# EAGLE design Titan_v1p0 (EAGLE 9.6.2)
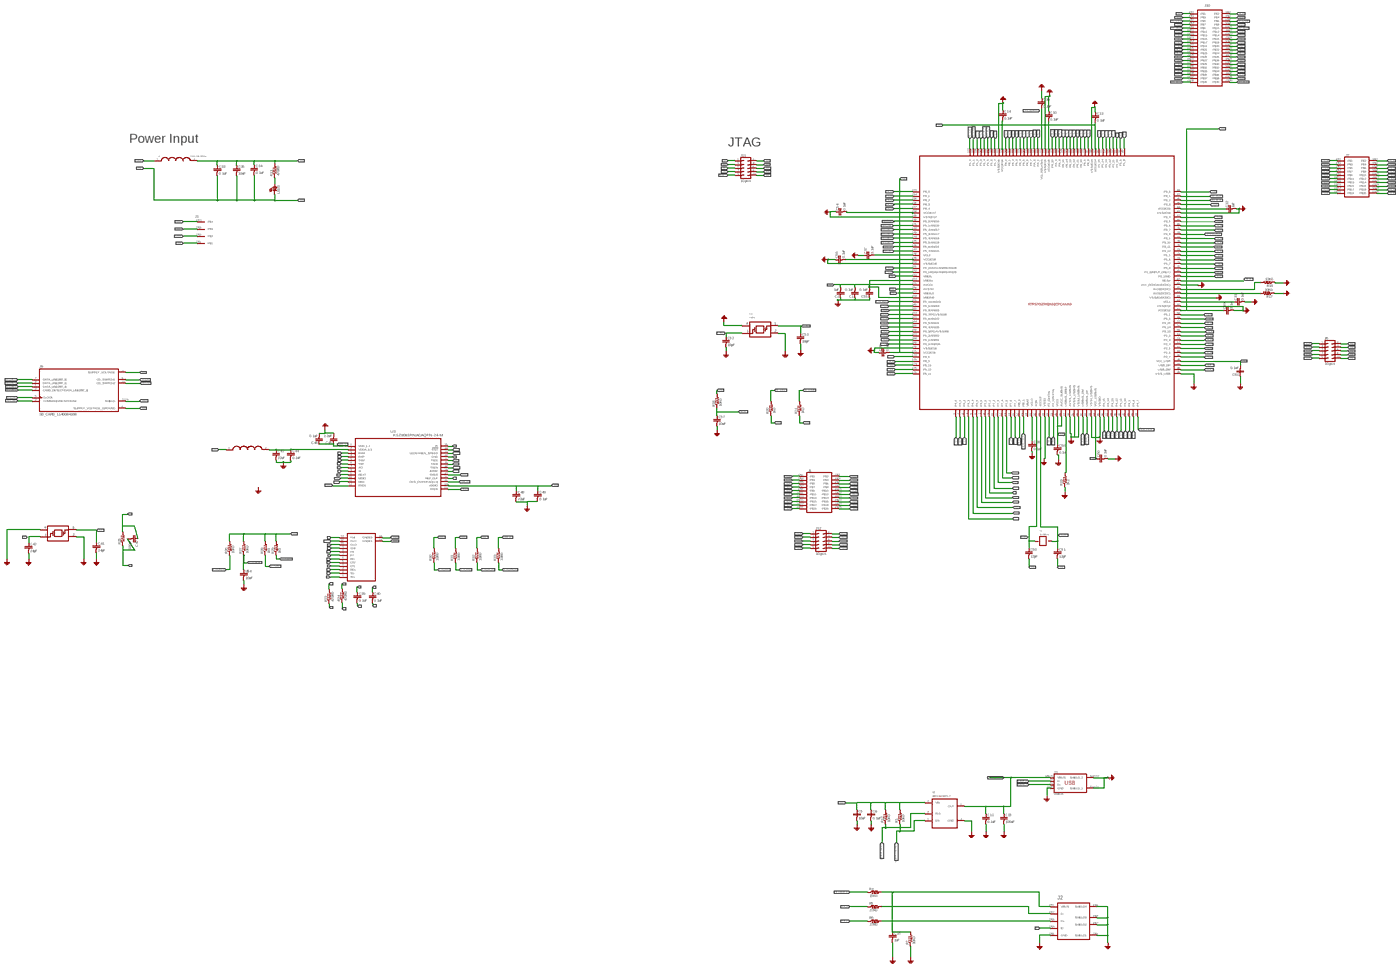
[diagram p0: schematic, sheet 1, overview]
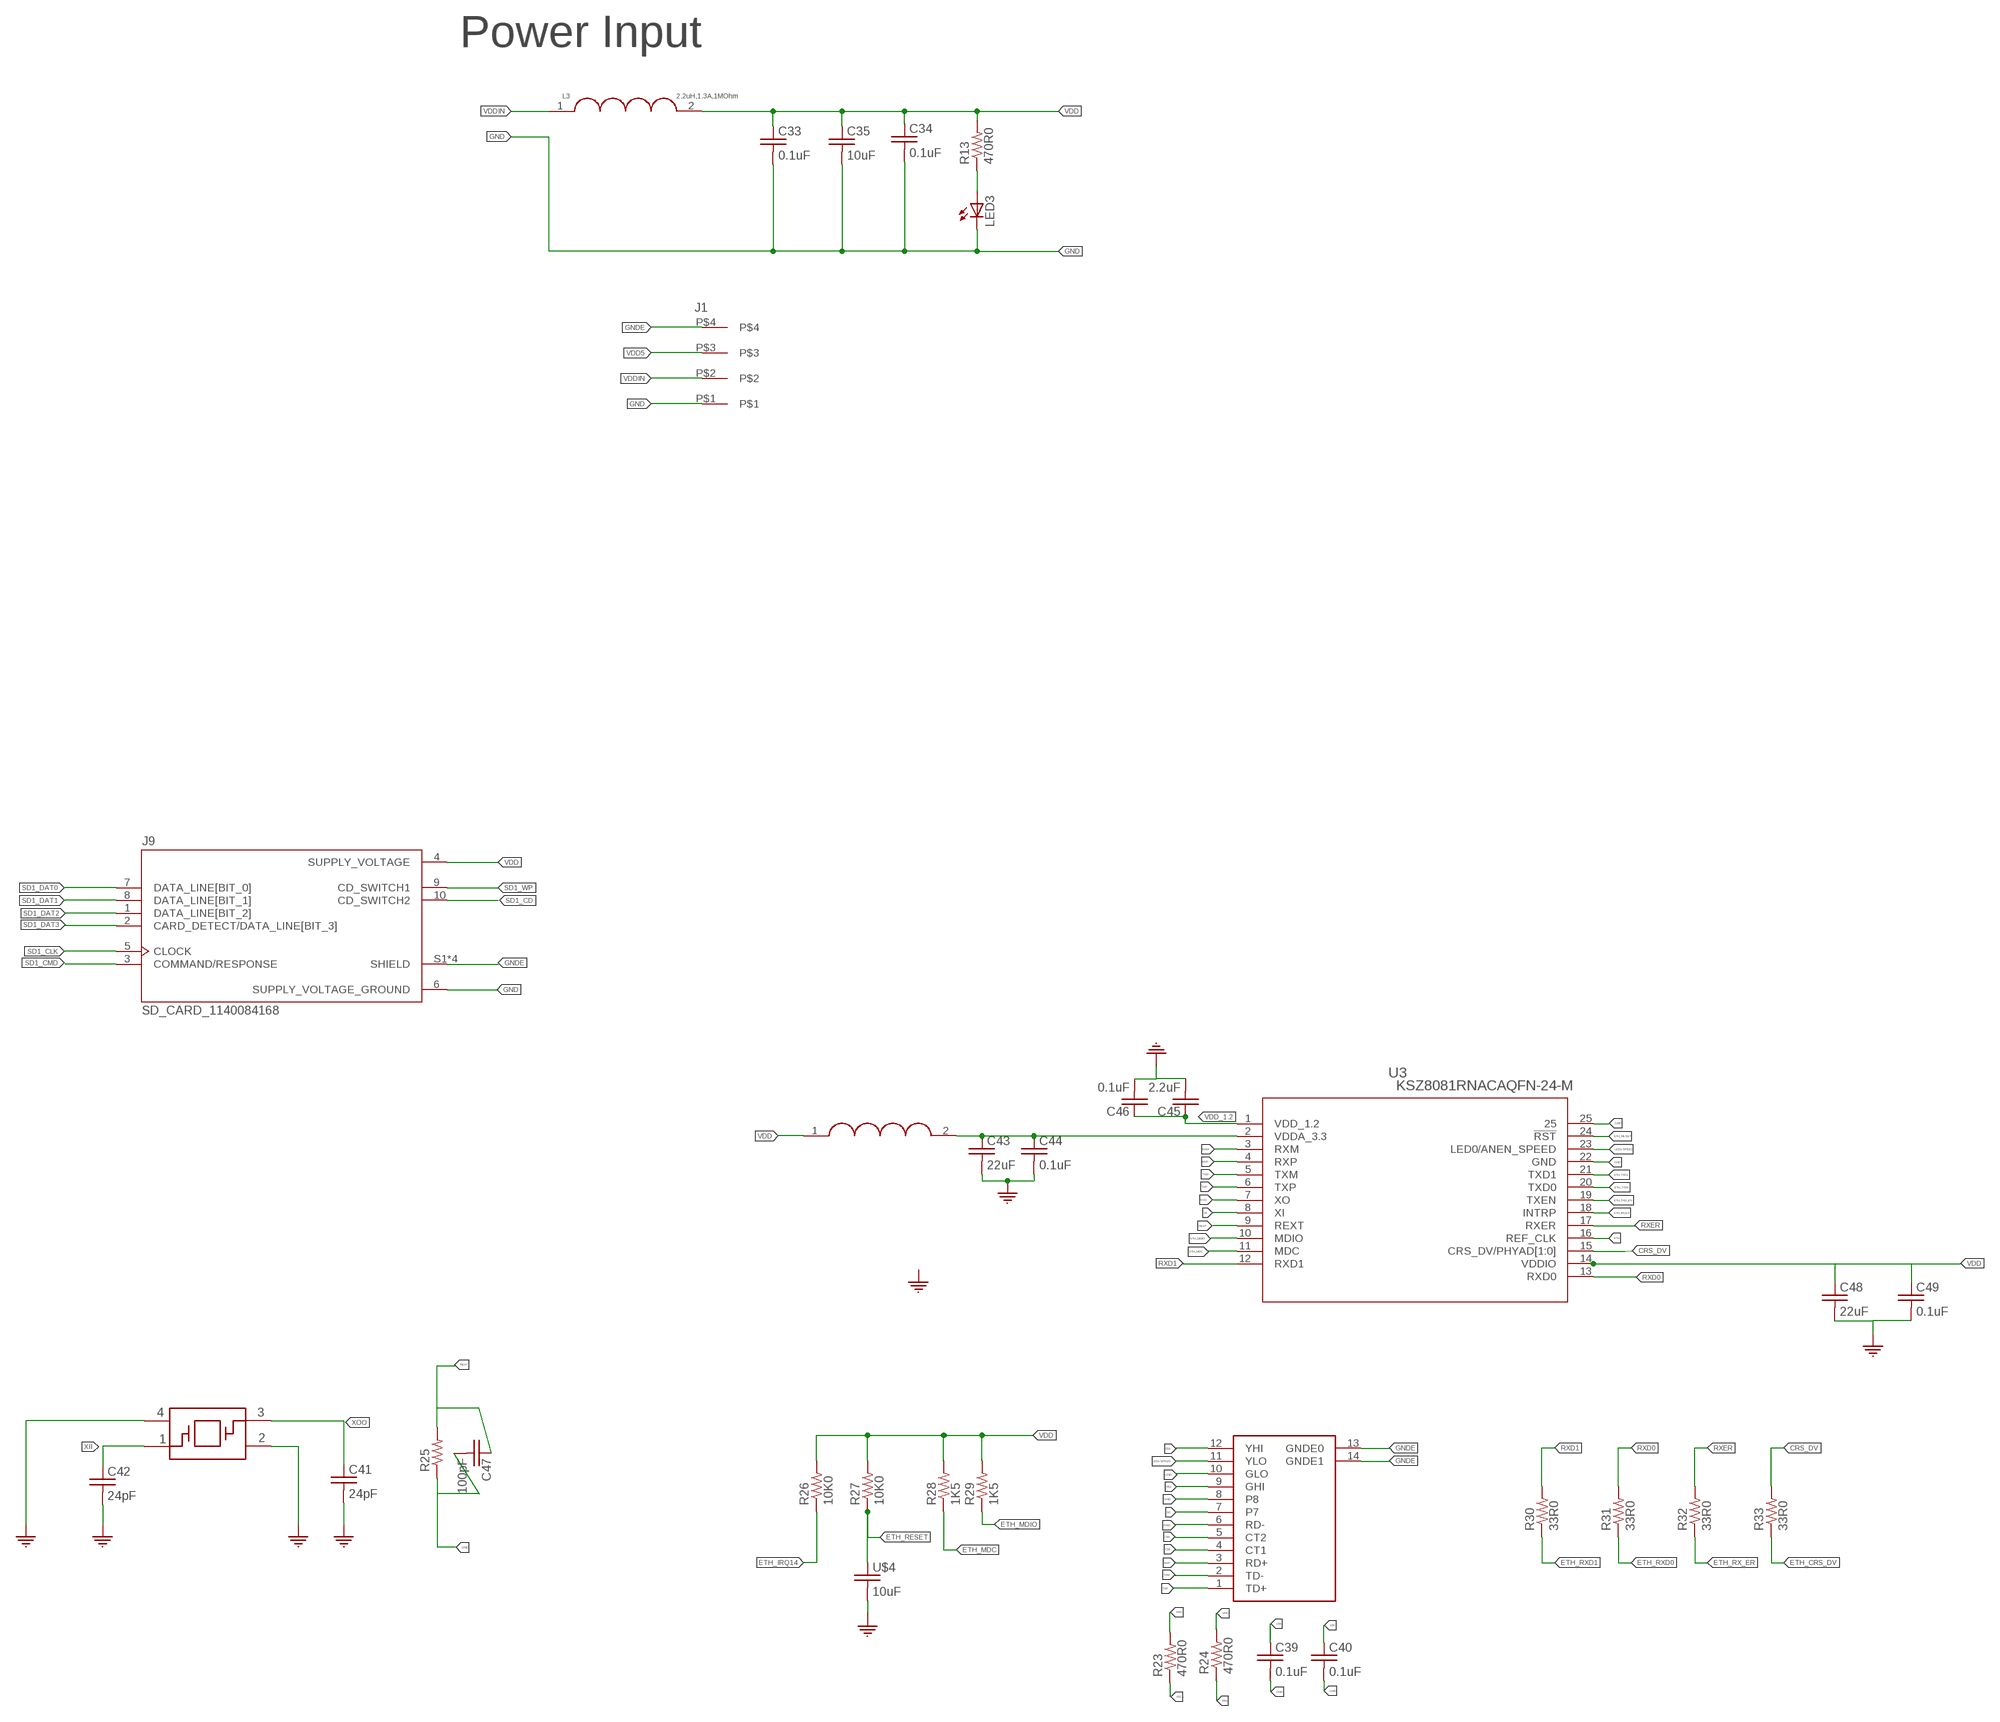
[diagram p1: schematic, sheet 1, part 1 of 4]
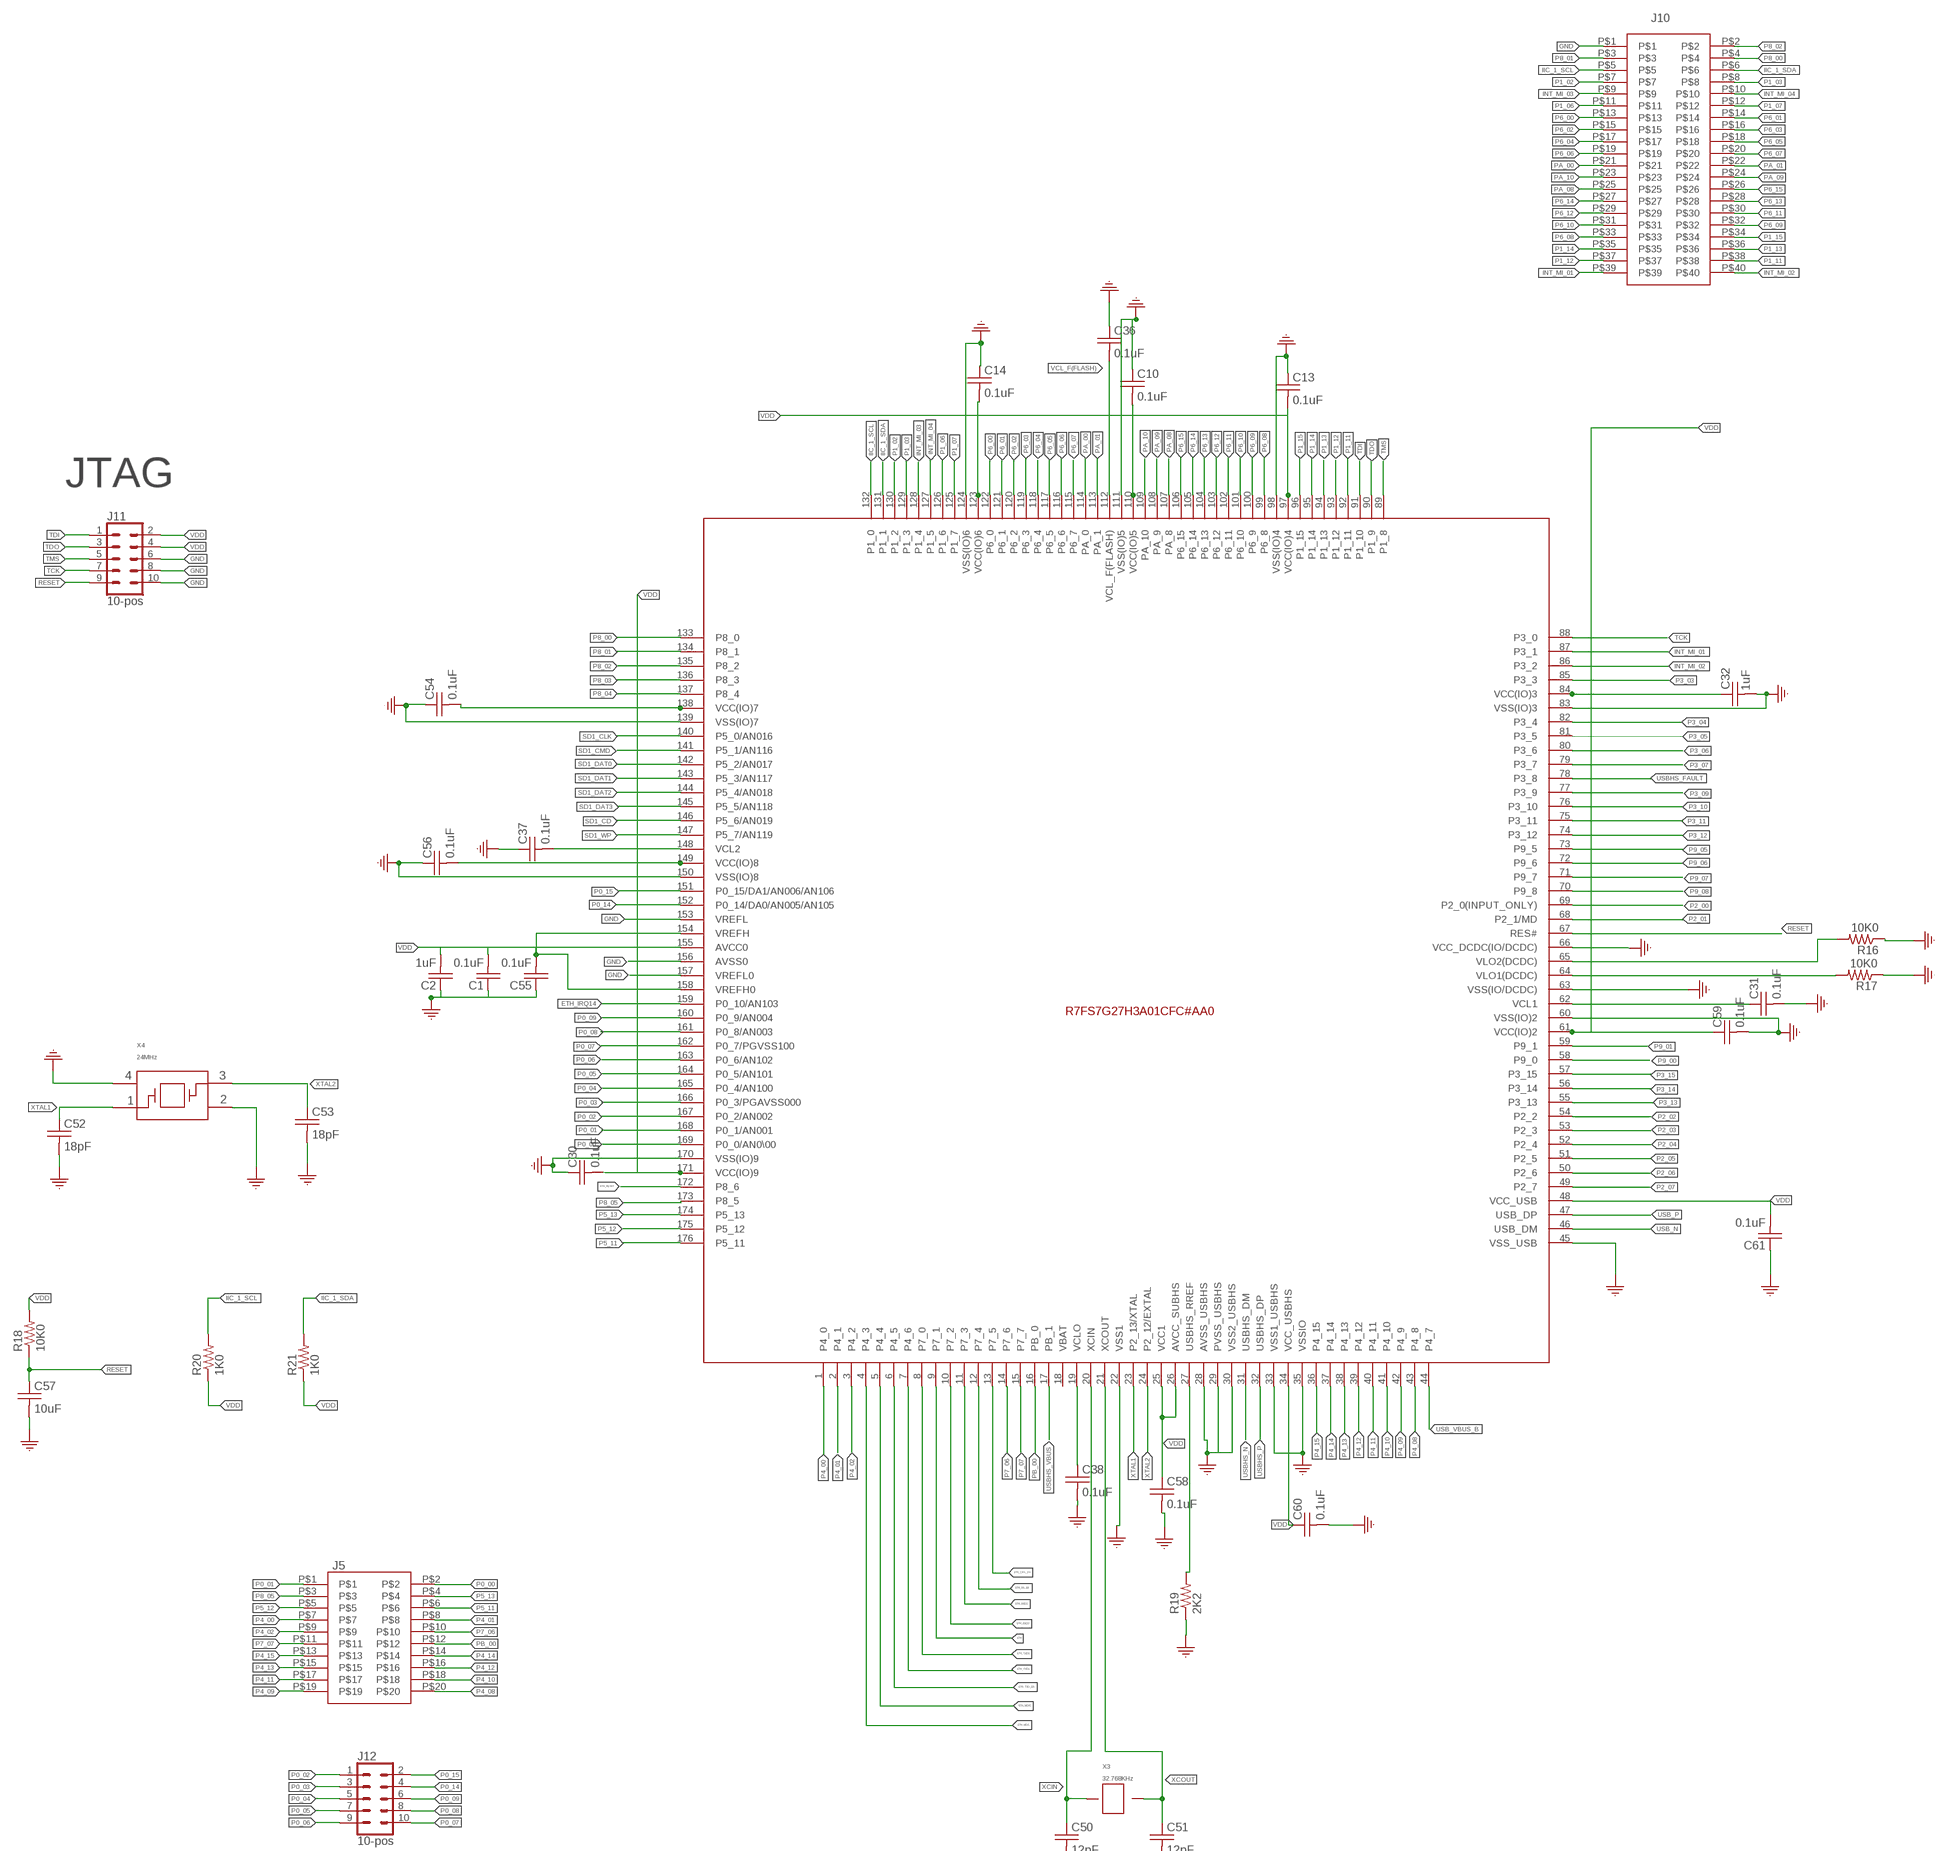
[diagram p2: schematic, sheet 1, part 2 of 4]
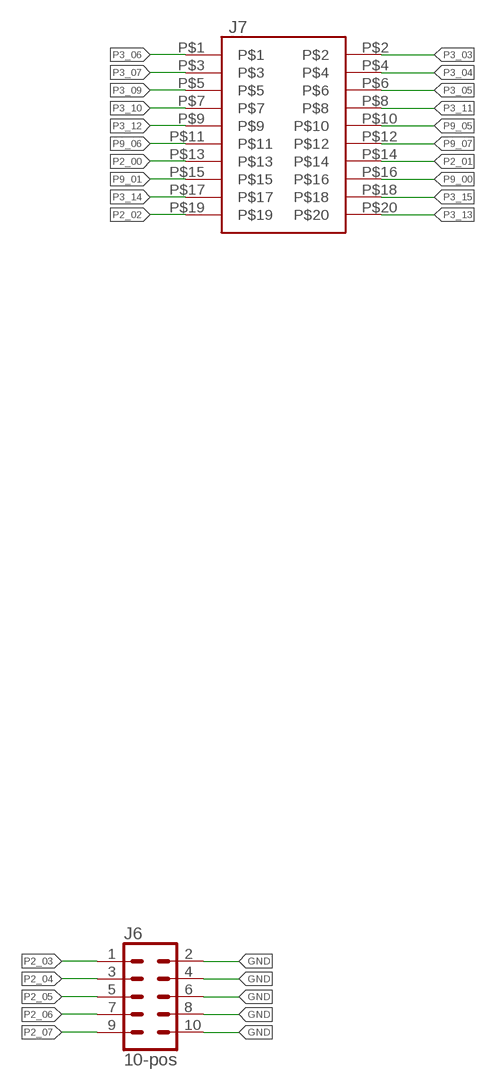
[diagram p3: schematic, sheet 1, part 3 of 4]
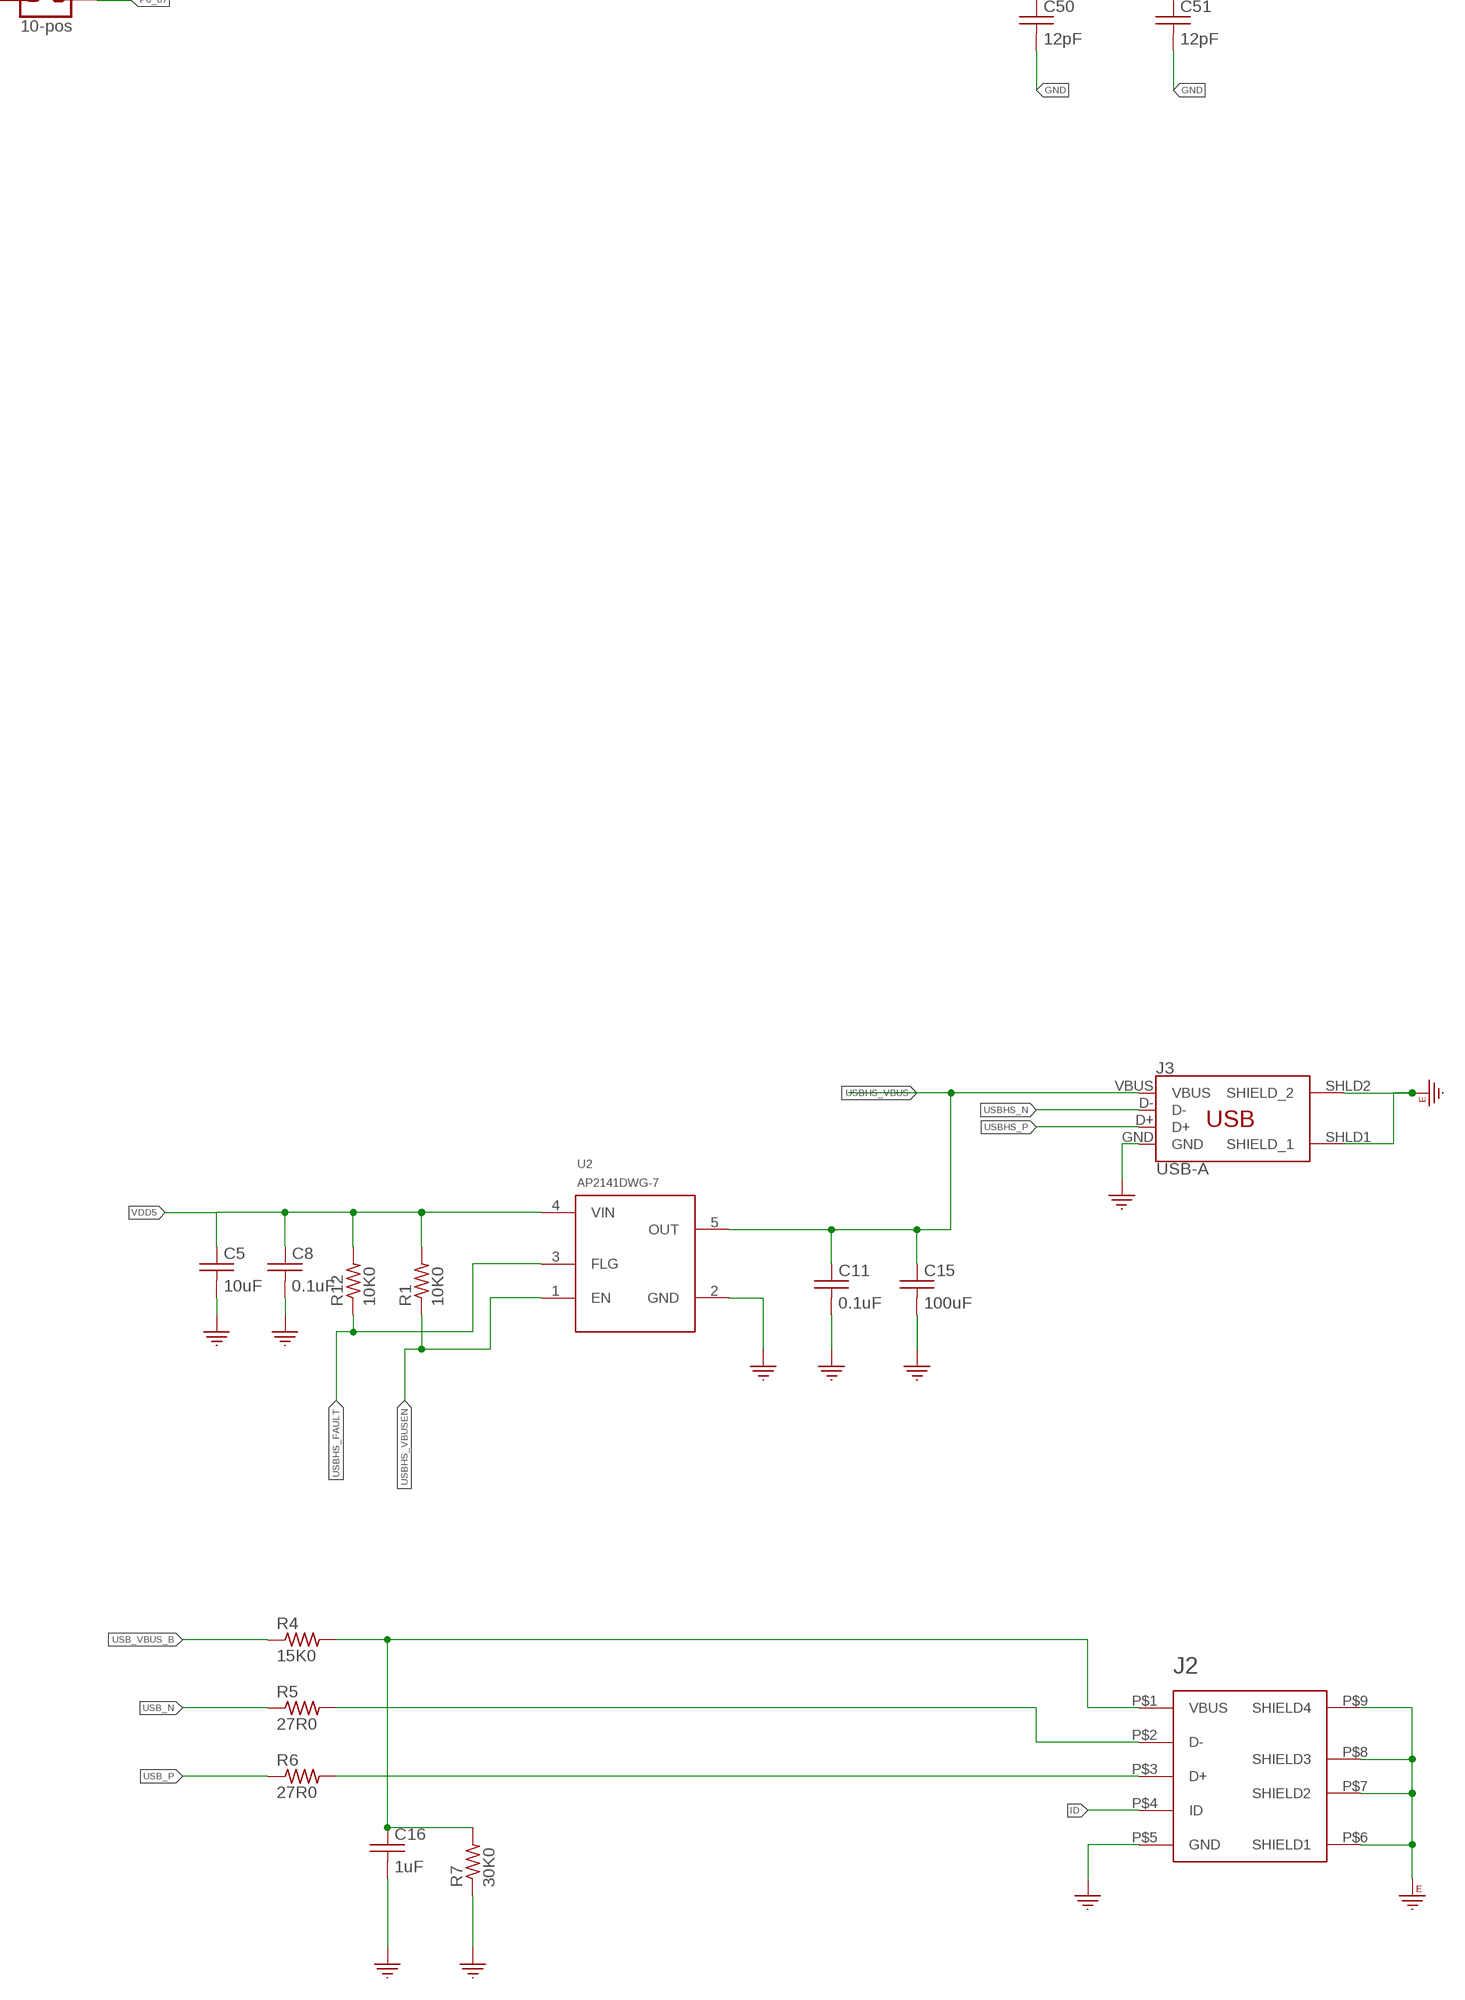
[diagram p4: schematic, sheet 1, part 4 of 4]

## Parts
C1  0.1uF  C_0402_0.1UF  [0402]
C2  1uF  C_0402_1UF  [0402]
C5  10uF  C_0402_10UF  [0402]
C8  0.1uF  C_0402_0.1UF  [0402]
C10  0.1uF  C_0402_0.1UF  [0402]
C11  0.1uF  C_0402_0.1UF  [0402]
C13  0.1uF  C_0402_0.1UF  [0402]
C14  0.1uF  C_0402_0.1UF  [0402]
C15  100uF  C_1210  [C1210]
C16  1uF  C_0402_1UF  [0402]
C30  0.1uF  C_0402_0.1UF  [0402]
C31  0.1uF  C_0402_0.1UF  [0402]
C32  1uF  C_0402_1UF  [0402]
C33  0.1uF  C_0402_0.1UF  [0402]
C34  0.1uF  C_0402_0.1UF  [0402]
C35  10uF  C_0402_10UF  [0402]
C36  0.1uF  C_0402_0.1UF  [0402]
C37  0.1uF  C_0402_0.1UF  [0402]
C38  0.1uF  C_0402_0.1UF  [0402]
C39  0.1uF  C_0402_0.1UF  [0402]
C40  0.1uF  C_0402_0.1UF  [0402]
C41  24pF  C_0402_24PF  [0402]
C42  24pF  C_0402_24PF  [0402]
C43  22uF  C_0402_22UF  [0402]
C44  0.1uF  C_0402_0.1UF  [0402]
C45  2.2uF  C_0402_2.2UF  [0402]
C46  0.1uF  C_0402_0.1UF  [0402]
C47  100pF  C_0402_100PF  [0402]
C48  22uF  C_0402_22UF  [0402]
C49  0.1uF  C_0402_0.1UF  [0402]
C50  12pF  C_0402_12PF  [0402]
C51  12pF  C_0402_12PF  [0402]
C52  18pF  C_0402_18PF  [0402]
C53  18pF  C_0402_18PF  [0402]
C54  0.1uF  C_0402_0.1UF  [0402]
C55  0.1uF  C_0402_0.1UF  [0402]
C56  0.1uF  C_0402_0.1UF  [0402]
C57  10uF  C_0402_10UF  [0402]
C58  0.1uF  C_0402_0.1UF  [0402]
C59  0.1uF  C_0402_0.1UF  [0402]
C60  0.1uF  C_0402_0.1UF  [0402]
C61  0.1uF  C_0402_0.1UF  [0402]
FB2/2  120Ohm  FB_0603_120_OHM0603  [0603]
J1  4-pos  3.81MM_1_X_4_RT_ANGLE_PLUG_HEADER  [1X4_3.81MM_PITCH]
J2  USB-B-Micro  USB_MICRO-B  [USB_MICRO-B]
J3  USB-A  USB_A  [USB_A_SMT]
J4  RJ45  RJ45_WITH_ELEC  [RJ45_TH_ELEC]
J5  20-pos  2_X_10_HEADER_GENERIC  [2_X_10_.1_INCH]
J6  10-pos  CONN_05X2_RAPTH  [2X5]
J7  20-pos  2_X_10_HEADER_GENERIC  [2_X_10_.1_INCH]
J9  SD_CARD_1140084168  [AMPHENOL_1140084168]
J10  40-pos  HEADER_2_X_20_GENERIC  [HEADER_2_X_20_.1_INCH]
J11  10-pos  CONN_05X2_RAPTH  [2X5]
J12  10-pos  CONN_05X2_RAPTH  [2X5]
L3  2.2uH,1.3A,1MOhm  INDUCTOR_1008_2.2_MH_1.3A  [1008]
LED3  Green  LED_0805_GREEN  [0805]
R1  10K0  R_0402_10K0  [0402]
R4  15K0  R_0402_15K0  [0402]
R5  27R0  R_0402_27R0  [0402]
R6  27R0  R_0402_27R0  [0402]
R7  30K0  R_0402_30K0  [0402]
R12  10K0  R_0402_10K0  [0402]
R13  470R0  R_0402_470R0  [0402]
R16  10K0  R_0402_10K0  [0402]
R17  10K0  R_0402_10K0  [0402]
R18  10K0  R_0402_10K0  [0402]
R19  2K2  R_0402_2K2  [0402]
R20  1K0  R_0402_1K0  [0402]
R21  1K0  R_0402_1K0  [0402]
R23  470R0  R_0402_470R0  [0402]
R24  470R0  R_0402_470R0  [0402]
R25  6K49  R_0402_6K49  [0402]
R26  10K0  R_0402_10K0  [0402]
R27  10K0  R_0402_10K0  [0402]
R28  1K5  R_0402_1K5  [0402]
R29  1K5  R_0402_1K5  [0402]
R30  33R0  R_0402_33R0  [0402]
R31  33R0  R_0402_33R0  [0402]
R32  33R0  R_0402_33R0  [0402]
R33  33R0  R_0402_33R0  [0402]
U2  AP2151DWG-7  [SOT-23-5]
U3  KSZ8081RNACAQFN-24-M  [QFN-24-M]
U4  S7G2LQFP176  S7G2_X_176  [LQFP176_24X24]
U5  25MHz  XTAL_25_MHZ  [SMD_3225]
U$4  10uF  C_0402_10UF  [0402]
X3  32.768KHz  XTAL_32.768KHZ  [SMD_X_2_PADS]
X4  24MHz  XTAL_24_MHZ  [SMD_3225]

## Nets
C58: C39.P$1 J4.4(CT1)
C60: C40.P$1 J4.5(CT2)
CRS_DV: R33.P$2 U3.15(CRS_DV/PHYAD[1:0])
D+: J2.P$3(D+) R6.P$2
D-: J2.P$2(D-) R5.P$2
ETH: U3.16(REF_CLK) U4.9(P7_1)
ETH_CRS_DV: R33.P$1 U4.13(P7_5)
ETH_IRQ14: R26.P$1 U3.18(INTRP) U4.159(P0_10/AN103)
ETH_MDC: R28.P$1 U3.11(MDC) U4.4(P4_3)
ETH_MDIO: R29.P$1 U3.10(MDIO) U4.5(P4_4)
ETH_RESET: R27.P$1 U3.24(!RST) U4.172(P8_6) U$4.P$1
ETH_RX_ER: R32.P$1 U4.12(P7_4)
ETH_RXD0: R31.P$1 U4.10(P7_2)
ETH_RXD1: R30.P$1 U4.11(P7_3)
ETH_TXD0: U3.20(TXD0) U4.8(P7_0)
ETH_TXD1: U3.21(TXD1) U4.7(P4_6)
ETH_TXD_EN: U3.19(TXEN) U4.6(P4_5)
GND: C1.P$1 C2.P$1 C5.P$2 C8.P$2 C10.P$1 C11.P$2 C13.P$1 C14.P$1 C15.2 C16.P$2 C30.P$1 C31.P$2 C32.P$2 C33.P$2 C34.P$2 C35.P$2 C36.P$1 C37.P$1 C38.P$2 C39.P$2 C40.P$2 C41.P$2 C42.P$2 C43.P$2 C44.P$2 C45.P$2 C46.P$2 C47.P$2 C48.P$2 C49.P$2 C50.P$2 C51.P$2 C52.P$2 C53.P$2 C54.P$1 C55.P$1 C56.P$1 C57.P$2 C58.P$2 C59.P$2 C60.P$2 C61.P$1 J1.P$1 J2.P$5(GND) J3.GND J4.8 J4.10(GLO) J6.2 J6.4 J6.6 J6.8 J6.10 J9.6(SUPPLY_VOLTAGE_GROUND) J10.P$1 J11.6 J11.8 J11.10 LED3.2(C) R7.P$1 R16.P$1 R17.P$1 R19.P$1 R25.P$1 U2.2(GND) U3.22(GND) U3.25 U4.22(VSS1) U4.28(AVSS_USBHS) U4.29(PVSS_USBHS) U4.30(VSS2_USBHS) U4.33(VSS1_USBHS) U4.35(VSSIO) U4.45(VSS_USB) U4.60(VSS(IO)2) U4.63(VSS(IO/DCDC)) U4.66(VCC_DCDC(IO/DCDC)) U4.83(VSS(IO)3) U4.98(VSS(IO)4) U4.111(VSS(IO)5) U4.124(VSS(IO)6) U4.139(VSS(IO)7) U4.150(VSS(IO)8) U4.153(VREFL) U4.156(AVSS0) U4.157(VREFL0) U4.170(VSS(IO)9) U5.2 U5.4 U$4.P$2 X4.2 X4.4
GNDE: J1.P$4 J2.P$6(SHIELD1) J2.P$7(SHIELD2) J2.P$8(SHIELD3) J2.P$9(SHIELD4) J3.SHLD1(SHIELD_1) J3.SHLD2(SHIELD_2) J4.13(GNDE0) J4.14(GNDE1) J9.S1(SHIELD) J9.S2(SHIELD) J9.S3(SHIELD) J9.S4(SHIELD)
ID: J2.P$4(ID)
IIC_1_SCL: J10.P$5 R20.P$2 U4.132(P1_0)
IIC_1_SDA: J10.P$6 R21.P$2 U4.131(P1_1)
INT_MI_01: J10.P$39 U4.87(P3_1)
INT_MI_02: J10.P$40 U4.86(P3_2)
INT_MI_03: J10.P$9 U4.128(P1_4)
INT_MI_04: J10.P$10 U4.127(P1_5)
LED1/SPEED: J4.11(YLO) U3.23(LED0/ANEN_SPEED)
N$1: C37.P$2 U4.148(VCL2)
N$3: LED3.1(A) R13.P$1
N$4: C38.P$1 U4.19(VCLO)
N$5: C31.P$1 U4.62(VCL1)
N$6: R17.P$2 U4.64(VLO1(DCDC))
N$7: R16.P$2 U4.65(VLO2(DCDC))
N$8: R19.P$2 U4.27(USBHS_RREF)
NC: J4.7
P0_00: J5.P$2 U4.169(P0_0/AN0\00)
P0_01: J5.P$1 U4.168(P0_1/AN001)
P0_02: J12.1 U4.167(P0_2/AN002)
P0_03: J12.3 U4.166(P0_3/PGAVSS000)
P0_04: J12.5 U4.165(P0_4/AN100)
P0_05: J12.7 U4.164(P0_5/AN101)
P0_06: J12.9 U4.163(P0_6/AN102)
P0_07: J12.10 U4.162(P0_7/PGVSS100)
P0_08: J12.8 U4.161(P0_8/AN003)
P0_09: J12.6 U4.160(P0_9/AN004)
P0_14: J12.4 U4.152(P0_14/DA0/AN005/AN105)
P0_15: J12.2 U4.151(P0_15/DA1/AN006/AN106)
P1_02: J10.P$7 U4.130(P1_2)
P1_03: J10.P$8 U4.129(P1_3)
P1_06: J10.P$11 U4.126(P1_6)
P1_07: J10.P$12 U4.125(P1_7)
P1_11: J10.P$38 U4.92(P1_11)
P1_12: J10.P$37 U4.93(P1_12)
P1_13: J10.P$36 U4.94(P1_13)
P1_14: J10.P$35 U4.95(P1_14)
P1_15: J10.P$34 U4.96(P1_15)
P2_00: J7.P$13 U4.69(P2_0(INPUT_ONLY))
P2_01: J7.P$14 U4.68(P2_1/MD)
P2_02: J7.P$19 U4.54(P2_2)
P2_03: J6.1 U4.53(P2_3)
P2_04: J6.3 U4.52(P2_4)
P2_05: J6.5 U4.51(P2_5)
P2_06: J6.7 U4.50(P2_6)
P2_07: J6.9 U4.49(P2_7)
P3_03: J7.P$2 U4.85(P3_3)
P3_04: J7.P$4 U4.82(P3_4)
P3_05: J7.P$6 U4.81(P3_5)
P3_06: J7.P$1 U4.80(P3_6)
P3_07: J7.P$3 U4.79(P3_7)
P3_09: J7.P$5 U4.77(P3_9)
P3_10: J7.P$7 U4.76(P3_10)
P3_11: J7.P$8 U4.75(P3_11)
P3_12: J7.P$9 U4.74(P3_12)
P3_13: J7.P$20 U4.55(P3_13)
P3_14: J7.P$17 U4.56(P3_14)
P3_15: J7.P$18 U4.57(P3_15)
P4_00: J5.P$7 U4.1(P4_0)
P4_01: J5.P$8 U4.2(P4_1)
P4_02: J5.P$9 U4.3(P4_2)
P4_08: J5.P$20 U4.43(P4_8)
P4_09: J5.P$19 U4.42(P4_9)
P4_10: J5.P$18 U4.41(P4_10)
P4_11: J5.P$17 U4.40(P4_11)
P4_12: J5.P$16 U4.39(P4_12)
P4_13: J5.P$15 U4.38(P4_13)
P4_14: J5.P$14 U4.37(P4_14)
P4_15: J5.P$13 U4.36(P4_15)
P5_11: J5.P$6 U4.176(P5_11)
P5_12: J5.P$5 U4.175(P5_12)
P5_13: J5.P$4 U4.174(P5_13)
P6_00: J10.P$13 U4.122(P6_0)
P6_01: J10.P$14 U4.121(P6_1)
P6_02: J10.P$15 U4.120(P6_2)
P6_03: J10.P$16 U4.119(P6_3)
P6_04: J10.P$17 U4.118(P6_4)
P6_05: J10.P$18 U4.117(P6_5)
P6_06: J10.P$19 U4.116(P6_6)
P6_07: J10.P$20 U4.115(P6_7)
P6_08: J10.P$33 U4.99(P6_8)
P6_09: J10.P$32 U4.100(P6_9)
P6_10: J10.P$31 U4.101(P6_10)
P6_11: J10.P$30 U4.102(P6_11)
P6_12: J10.P$29 U4.103(P6_12)
P6_13: J10.P$28 U4.104(P6_13)
P6_14: J10.P$27 U4.105(P6_14)
P6_15: J10.P$26 U4.106(P6_15)
P7_06: J5.P$10 U4.14(P7_6)
P7_07: J5.P$11 U4.15(P7_7)
P8_00: J10.P$4 U4.133(P8_0)
P8_01: J10.P$3 U4.134(P8_1)
P8_02: J10.P$2 U4.135(P8_2)
P8_03: U4.136(P8_3)
P8_04: U4.137(P8_4)
P8_05: J5.P$3 U4.173(P8_5)
P9_00: J7.P$16 U4.58(P9_0)
P9_01: J7.P$15 U4.59(P9_1)
P9_05: J7.P$10 U4.73(P9_5)
P9_06: J7.P$11 U4.72(P9_6)
P9_07: J7.P$12 U4.71(P9_7)
P9_08: U4.70(P9_8)
PA_00: J10.P$21 U4.114(PA_0)
PA_01: J10.P$22 U4.113(PA_1)
PA_08: J10.P$25 U4.107(PA_8)
PA_09: J10.P$24 U4.108(PA_9)
PA_10: J10.P$23 U4.109(PA_10)
PB_00: J5.P$12 U4.16(PB_0)
R51: J4.12(YHI) R23.P$1
R52: J4.9(GHI) R24.P$1
RESET: C57.P$1 J11.9 R18.P$1 U4.67(RES#)
REXT: C47.P$1 R25.P$2 U3.9(REXT)
RXD0: R31.P$2 U3.13(RXD0)
RXD1: R30.P$2 U3.12(RXD1)
RXER: R32.P$2 U3.17(RXER)
RXM: J4.6(RD-) U3.3(RXM)
RXP: J4.3(RD+) U3.4(RXP)
SD1_CD: J9.10(CD_SWITCH2) U4.146(P5_6/AN019)
SD1_CLK: J9.5(CLOCK) U4.140(P5_0/AN016)
SD1_CMD: J9.3(COMMAND/RESPONSE) U4.141(P5_1/AN116)
SD1_DAT0: J9.7(DATA_LINE[BIT_0]) U4.142(P5_2/AN017)
SD1_DAT1: J9.8(DATA_LINE[BIT_1]) U4.143(P5_3/AN117)
SD1_DAT2: J9.1(DATA_LINE[BIT_2]) U4.144(P5_4/AN018)
SD1_DAT3: J9.2(CARD_DETECT/DATA_LINE[BIT_3]) U4.145(P5_5/AN118)
SD1_WP: J9.9(CD_SWITCH1) U4.147(P5_7/AN119)
TCK: J11.7 U4.88(P3_0)
TDI: J11.1 U4.91(P1_10)
TDO: J11.3 U4.90(P1_9)
TMS: J11.5 U4.89(P1_8)
TXM: J4.2(TD-) U3.5(TXM)
TXP: J4.1(TD+) U3.6(TXP)
USB_N: R5.P$1 U4.46(USB_DM)
USB_P: R6.P$1 U4.47(USB_DP)
USB_VBUS_B: R4.P$1 U4.44(P4_7)
USBHS_FAULT: R12.P$1 U2.3(FLG) U4.78(P3_8)
USBHS_N: J3.D- U4.31(USBHS_DM)
USBHS_P: J3.D+ U4.32(USBHS_DP)
USBHS_VBUS: C11.P$1 C15.1 J3.VBUS U2.5(OUT) U4.17(PB_1)
USBHS_VBUSEN: R1.P$1 U2.1(EN)
VBUS: C16.P$1 J2.P$1(VBUS) R4.P$2 R7.P$2
VCL_F(FLASH): C36.P$2 U4.112(VCL_F(FLASH))
VDD: C1.P$2 C2.P$2 C10.P$2 C13.P$2 C14.P$2 C30.P$2 C32.P$1 C33.P$1 C34.P$1 C35.P$1 C48.P$1 C49.P$1 C54.P$2 C55.P$2 C56.P$2 C58.P$1 C59.P$1 C60.P$1 C61.P$2 FB2/2.1 J9.4(SUPPLY_VOLTAGE) J11.2 J11.4 L3.2 R13.P$2 R18.P$2 R20.P$1 R21.P$1 R23.P$2 R24.P$2 R26.P$2 R27.P$2 R28.P$2 R29.P$2 U3.14(VDDIO) U4.25(VCC1) U4.26(AVCC_SUBHS) U4.34(VCC_USBHS) U4.48(VCC_USB) U4.61(VCC(IO)2) U4.84(VCC(IO)3) U4.97(VCC(IO)4) U4.110(VCC(IO)5) U4.123(VCC(IO)6) U4.138(VCC(IO)7) U4.149(VCC(IO)8) U4.154(VREFH) U4.155(AVCC0) U4.158(VREFH0) U4.171(VCC(IO)9)
VDD5: C5.P$1 C8.P$1 J1.P$3 R1.P$2 R12.P$2 U2.4(VIN)
VDD_1.2: C45.P$1 C46.P$1 U3.1(VDD_1.2)
VDD_ENET1: C43.P$1 C44.P$1 FB2/2.2 U3.2(VDDA_3.3)
VDDIN: J1.P$2 L3.1
XCIN: C50.P$1 U4.20(XCIN) X3.P$1
XCOUT: C51.P$1 U4.21(XCOUT) X3.P$2
XII: C42.P$1 U3.8(XI) U5.1
XOO: C41.P$1 U3.7(XO) U5.3
XTAL1: C52.P$1 U4.23(P2_13/XTAL) X4.1
XTAL2: C53.P$1 U4.24(P2_12/EXTAL) X4.3
Unconnected: U4.18(VBAT)

## Notes on the sheet
- Power Input | JTAG

## Library data of the parts
C1 C8 C10 C11 C13 C14 C30 C31 C33 C34 C36-C40 C44 C46 C49 C54-C56 C58-C61 = 3D_MIG_Controller:C_0402_0.1UF; PARTNO: CL05F104ZO5NNNC
C2 C16 C32 = 3D_MIG_Controller:C_0402_1UF; PARTNO: CL05A105KO5NNNC
C5 C35 C57 U$4 = 3D_MIG_Controller:C_0402_10UF; PARTNO: CL05A106MP8NUB8
C15 = 3D_MIG_Controller:C_1210; PARTNO: TL8A0107M010D
C41 C42 = 3D_MIG_Controller:C_0402_24PF; PARTNO: CC0402GRNPO9BN240
C43 C48 = 3D_MIG_Controller:C_0402_22UF; PARTNO: CL05A226MQ5N6J8
C45 = 3D_MIG_Controller:C_0402_2.2UF; PARTNO: GRM155C81C225ME15D
C47 = 3D_MIG_Controller:C_0402_100PF; PARTNO: CL05C101JB5NNNC
C50 C51 = 3D_MIG_Controller:C_0402_12PF; PARTNO: CL05C120JB5NNNC
C52 C53 = 3D_MIG_Controller:C_0402_18PF; PARTNO: UMK105CG180JV-F
FB2/2 = 3D_MIG_Controller:FB_0603_120_OHM; PARTNO: BLM18PG121SN1D
J1 = 3D_MIG_Controller:3.81MM_1_X_4_RT_ANGLE_PLUG_HEADER: 4 Position Terminal Block Header, Male Pins, Shrouded (4 Side) 0.150" (3.81mm) 90°, Right Angle - Through Hole; PARTNO: 691322310004
J2 = 3D_MIG_Controller:USB_MICRO-B; PARTNO: 10118192-0002LF
J3 = 3D_MIG_Controller:USB_A: USB-A Connector Male and female variants, as well as PTH and SMT variants SparkFun Products: SparkFun XBee Explorer Dongle <https://www.sparkfun.com/products/11697> PTH Male SparkFun MicroView-USB Programmer <https://www.sparkfun.com/products/12924> SMT Male SparkFun USB Type A Female Breakout <https://www.sparkfun.com/products/12700> SMT Female; PARTNO: 87583-3010RPALF
J4 = 3D_MIG_Controller:RJ45_WITH_ELEC; MAN: Shanghai YDS Tech; PARTNO: 13F-64GYD2PL2NL; VENDOR: lcsc.com
J5 J7 = 3D_MIG_Controller:2_X_10_HEADER_GENERIC: CONN HEADER R/A 20POS 2.54MM, Straight, Right Angle; PARTNO: 67996-420HLF
J6 J11 J12 = 3D_MIG_Controller:CONN_05X2_RA: Connector Header Through Hole, Right Angle 10 position 0.100" (2.54mm); PARTNO: PH2RA-10-UA
J9 = 3D_MIG_Controller:SD_CARD_1140084168: Conn; IC Socket; Micro SD; Right Angle; PCB Mount; MicroSD Ser.:: 10 _8 + 2_ Position Card Connector Secure Digital - microSD™ Surface Mount, Right Angle Gold; MF: Amphenol ICC; PARTNO: 114-00841-68; VID: Digikey; VP: 114-00841-68-1-ND; VURL: https://www.digikey.ae/product-detail/en/amphenol-icc-commercial-products/114-00841-68/114-00841-68-1-ND/2187101?utm_source=snapeda&utm_medium=aggregator&utm_campaign=symbol
J10 = 3D_MIG_Controller:HEADER_2_X_20_GENERIC: CONN HEADER R/A 40POS 2.54MM; PARTNO: 61304021021
L3 = 3D_MIG_Controller:INDUCTOR_1008_2.2_MH_1.3A; PARTNO: LQM2HPN2R2MG0L
LED3 = 3D_MIG_Controller:LED_0805_GREEN: Green 570nm LED Indication - Discrete 2.2V 0805 (2012 Metric); PARTNO: LG R971-KN-1
R1 R12 R16-R18 R26 R27 = 3D_MIG_Controller:R_0402_10K0; PARTNO: RMCF0402JT10K0
R4 = 3D_MIG_Controller:R_0402_15K0; PARTNO: RMCF0402JT15K0
R5 R6 = 3D_MIG_Controller:R_0402_27R0; PARTNO: RMCF0402JT27R0
R7 = 3D_MIG_Controller:R_0402_30K0; PARTNO: RC0402JR-0730KL
R13 R23 R24 = 3D_MIG_Controller:R_0402_470R0; PARTNO: RMCF0402JT470R
R19 = 3D_MIG_Controller:R_0402_2K2; PARTNO: RMCF0402JT2K20
R20 R21 = 3D_MIG_Controller:R_0402_1K0; PARTNO: CRG0402J1K0
R25 = 3D_MIG_Controller:R_0402_6K49; PARTNO: RMCF0402FT6K49
R28 R29 = 3D_MIG_Controller:R_0402_1K5; PARTNO: RMCF0402JT1K50
R30-R33 = 3D_MIG_Controller:R_0402_33R0; PARTNO: RMCF0402JT33R0
U2 = 3D_MIG_Controller:AP2151DWG-7: Power Switch/Driver 1:1 P-Channel 500mA SOT-25; PARTNO: AP2151WG-7
U3 = 3D_MIG_Controller:KSZ8081RNACA; PARTNO: KSZ8081RNACA; VENDOR: Micrel
U4 = 3D_MIG_Controller:S7G2_X_176; PARTNO: R7FS7G27H3A01CFC#AA0
U5 = 3D_MIG_Controller:XTAL_25_MHZ; PARTNO: FA-238 25.0000MB-B3
X3 = 3D_MIG_Controller:XTAL_32.768KHZ; PARTNO: ABS07-32.768KHZ-T
X4 = 3D_MIG_Controller:XTAL_24_MHZ; PARTNO: FA-238 24.0000MB-C3

## Board
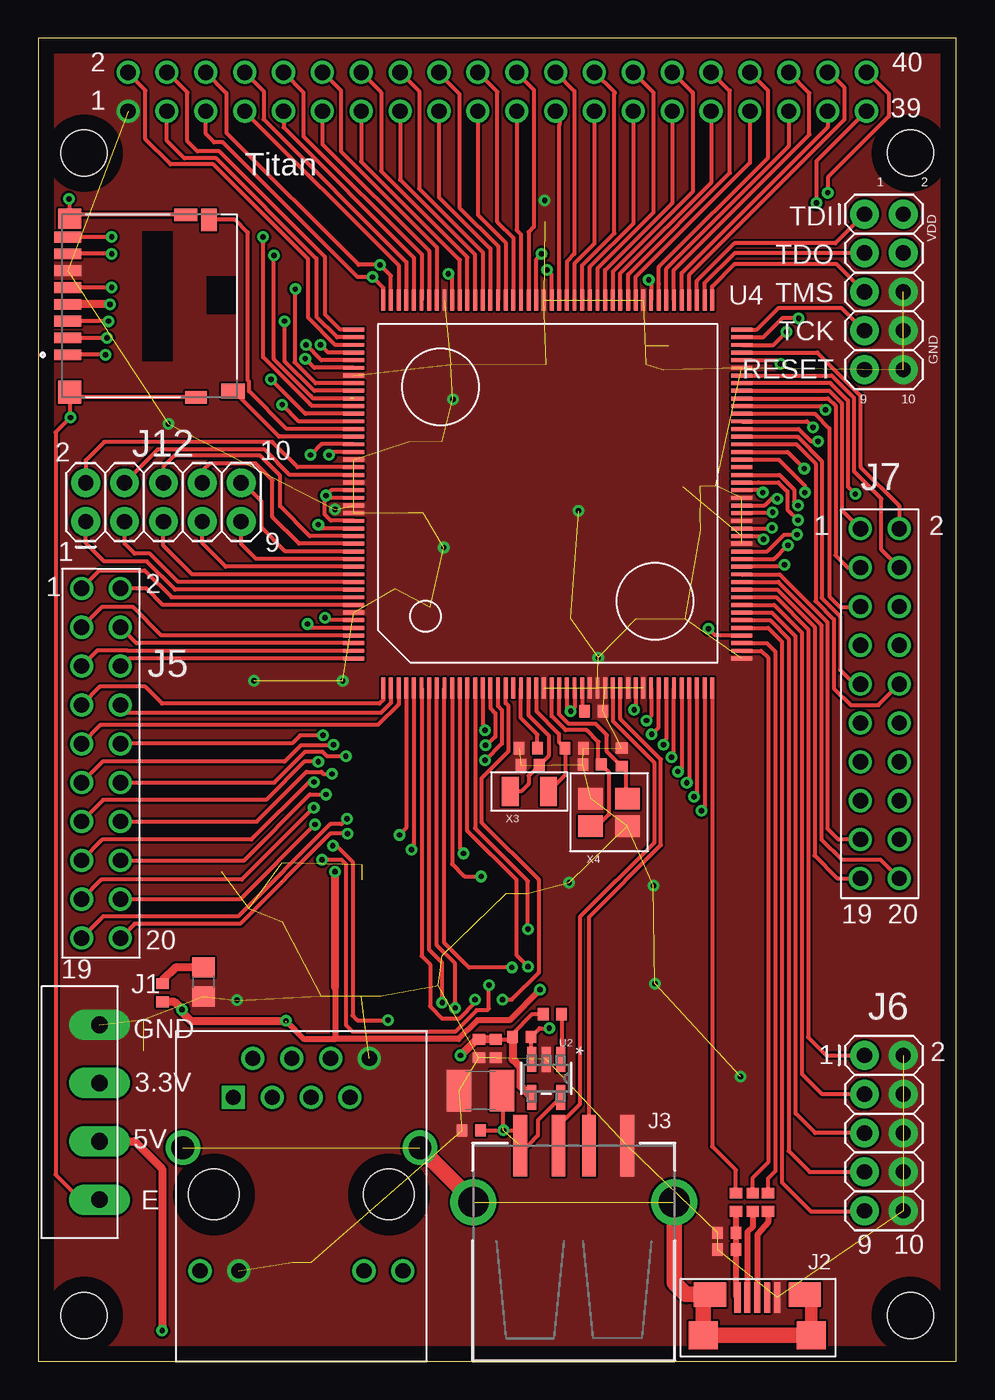
[diagram p5: board, top side]
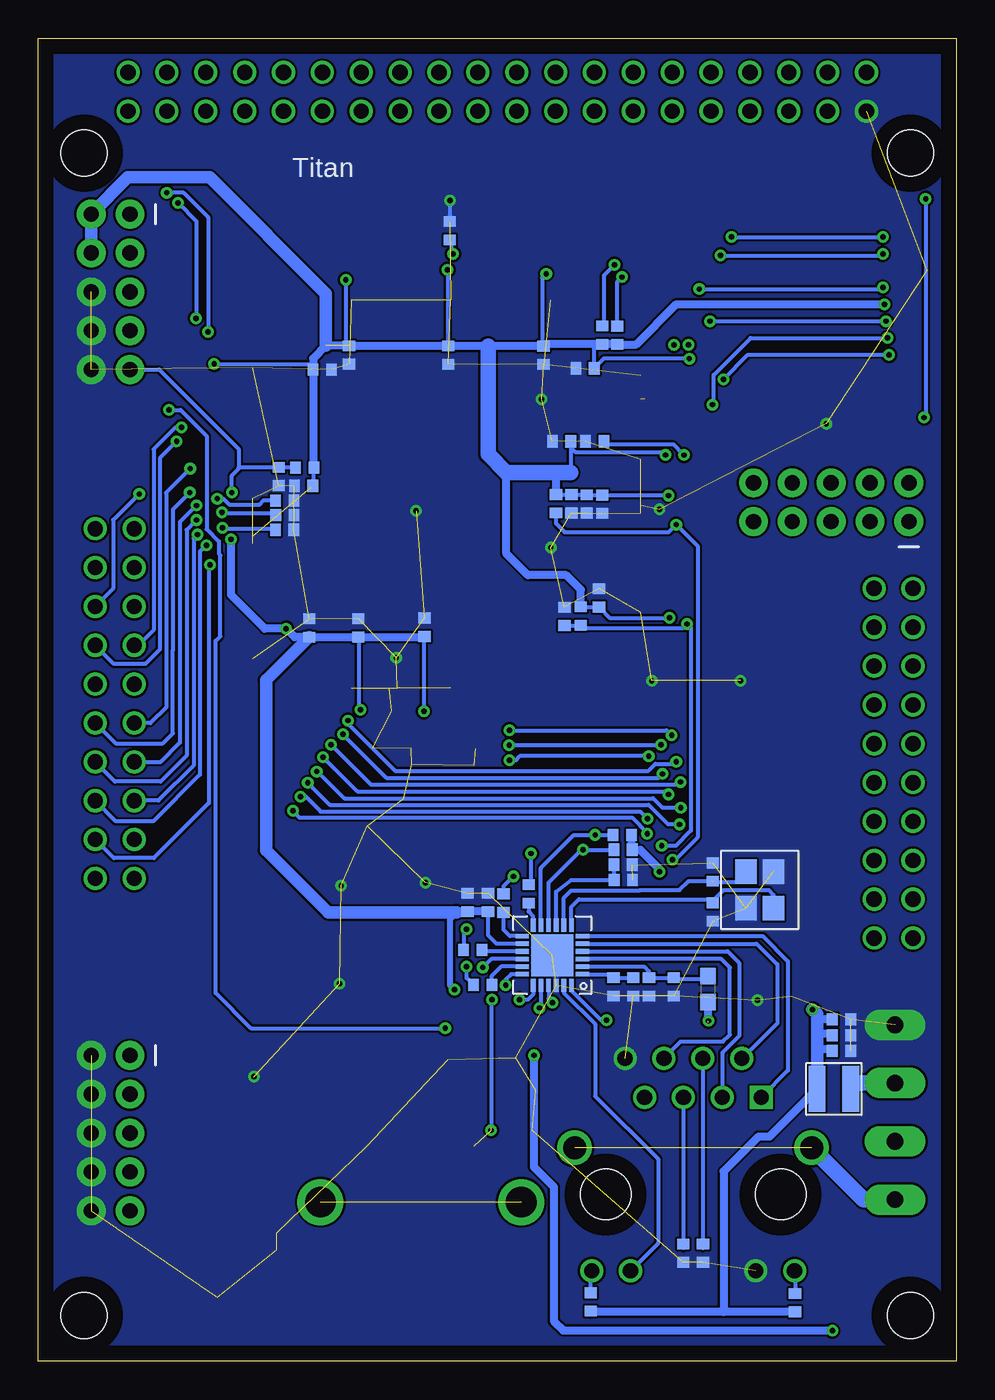
[diagram p6: board, bottom side, seen from below]

Size 60 x 86.5 mm. Coordinates in mm from the lower left corner, seen from the top.
Outline: 0,0 60,0 60,86.5 0,86.5 0,0
Copper layers (1*16): Top 0.035mm / dielectric 1.5mm / Bottom 0.035mm
Design rules "default": minimum track width 6mil, minimum drill 0.35mm, track to track 6mil, track to pad 6mil, pad to pad 6mil, via to via 6mil, smd to smd 6mil, copper to edge 40mil, drill to drill 6mil, minimum pad ring 10mil, minimum via ring 8mil, stop-mask expansion 4mil, vias tented up to drill 0mil, thermal gap 10mil
Holes 3 mm at 3,79 57,79 57,3 3,3

### Footprints (pad centres in the part's own frame; a part is rotated, then mirrored left to right if it is on the bottom)
0402 = smd 0.8 x 0.7: P$1 0,0.6; P$2 0,-0.6
C1210 = smd 1.6 x 2.7: 1 -1.4,0; 2 1.4,0
0603 = smd 1.1 x 1: 1 -0.85,0; 2 0.85,0
1X4_3.81MM_PITCH = drill 1.1 pad 2 long: P$1 0,0; P$2 3.81,0; P$3 7.62,0; P$4 11.43,0
USB_MICRO-B = smd 0.4 x 2: P$1 -1.3,2.475; P$2 -0.65,2.475; P$3 0,2.475; P$4 0.65,2.475; P$5 1.3,2.475 | smd 2.1 x 1.6: P$6 -3.1,2.675; P$7 3.1,2.675 | smd 1.9 x 1.8: P$8 -3.525,0; P$9 3.525,0
USB_A_SMT = smd 4 x 0.9: D+ 6.7,-1; D- 6.7,1; GND 6.7,-3.5; VBUS 6.7,3.5 | drill 2: SHLD1 3,-6.566; SHLD2 3,6.566
RJ45_TH_ELEC = drill 1 square: 1 -4.45,-2.54 | drill 1: 2 -3.18,0; 3 -1.91,-2.54; 4 -0.635,0; 5 0.635,-2.54; 6 1.91,0; 7 3.17,-2.54; 8 4.445,0; 9 -6.63,-13.88; 10 -4.09,-13.88; 11 4.09,-13.88; 12 6.63,-13.88 | drill 1.5: 13 -7.75,-5.84; 14 7.75,-5.84 | hole 3.299: 5.715,-8.89; -5.715,-8.89
2_X_10_.1_INCH = drill 1: P$1 -11.43,-1.27; P$2 -11.43,1.27; P$3 -8.89,-1.27; P$4 -8.89,1.27; P$5 -6.35,-1.27; P$6 -6.35,1.27; P$7 -3.81,-1.27; P$8 -3.81,1.27; P$9 -1.27,-1.27; P$10 -1.27,1.27; P$11 1.27,-1.27; P$12 1.27,1.27; P$13 3.81,-1.27; P$14 3.81,1.27; P$15 6.35,-1.27; P$16 6.35,1.27; P$17 8.89,-1.27; P$18 8.89,1.27; P$19 11.43,-1.27; P$20 11.43,1.27
2X5 = drill 1 pad 1.88: 1 0,0; 2 0,2.54; 3 2.54,0; 4 2.54,2.54; 5 5.08,0; 6 5.08,2.54; 7 7.62,0; 8 7.62,2.54; 9 10.16,0; 10 10.16,2.54
AMPHENOL_1140084168 = smd 0.7 x 1.75: 1 3.2,-0.875; 2 2.1,-0.875; 3 1,-0.875; 4 -0.1,-0.875; 5 -1.2,-0.875; 6 -2.3,-0.875; 7 -3.4,-0.875; 8 -4.5,-0.875 | smd 1 x 1.55: 9 5.575,9.925 | smd 1.45 x 1: 10 -5.625,8.35 | smd 1.5 x 1.5: S1 5.65,-0.75 | smd 1.3 x 1.5: S2 -5.7,-0.75 | smd 0.8 x 1.4: S3 5.975,7.5 | smd 0.8 x 1.5: S4 -5.95,6.85
HEADER_2_X_20_.1_INCH = drill 1: P$1 -24.13,-1.27; P$2 -24.13,1.27; P$3 -21.59,-1.27; P$4 -21.59,1.27; P$5 -19.05,-1.27; P$6 -19.05,1.27; P$7 -16.51,-1.27; P$8 -16.51,1.27; P$9 -13.97,-1.27; P$10 -13.97,1.27; P$11 -11.43,-1.27; P$12 -11.43,1.27; P$13 -8.89,-1.27; P$14 -8.89,1.27; P$15 -6.35,-1.27; P$16 -6.35,1.27; P$17 -3.81,-1.27; P$18 -3.81,1.27; P$19 -1.27,-1.27; P$20 -1.27,1.27; P$21 1.27,-1.27; P$22 1.27,1.27; P$23 3.81,-1.27; P$24 3.81,1.27; P$25 6.35,-1.27; P$26 6.35,1.27; P$27 8.89,-1.27; P$28 8.89,1.27; P$29 11.43,-1.27; P$30 11.43,1.27; P$31 13.97,-1.27; P$32 13.97,1.27; P$33 16.51,-1.27; P$34 16.51,1.27; P$35 19.05,-1.27; P$36 19.05,1.27; P$37 21.59,-1.27; P$38 21.59,1.27; P$39 24.13,-1.27; P$40 24.13,1.27
1008 = smd 3 x 1.1: 1 0,1.1; 2 0,-1.1
0805 = smd 1.3 x 1.5: 1 -0.95,0; 2 0.95,0
SOT-23-5 = smd 1.626 x 0.61: 1 -1.245,0.95; 2 -1.245,0; 3 -1.245,-0.95; 4 1.245,-0.95; 5 1.245,0.95
QFN-24-M = smd 0.864 x 0.305: 1 -1.968,1.25; 2 -1.968,0.75; 3 -1.968,0.25; 4 -1.968,-0.25; 5 -1.968,-0.75; 6 -1.968,-1.25; 13 1.968,-1.25; 14 1.968,-0.75; 15 1.968,-0.25; 16 1.968,0.25; 17 1.968,0.75; 18 1.968,1.25 | smd 0.305 x 0.864: 7 -1.25,-1.968; 8 -0.75,-1.968; 9 -0.25,-1.968; 10 0.25,-1.968; 11 0.75,-1.968; 12 1.25,-1.968; 19 1.25,1.968; 20 0.75,1.968; 21 0.25,1.968; 22 -0.25,1.968; 23 -0.75,1.968; 24 -1.25,1.968 | smd 2.743 x 2.743: 25 0,0
LQFP176_24X24 = smd 1.372 x 0.254: 1 -12.675,10.75; 2 -12.675,10.25; 3 -12.675,9.75; 4 -12.675,9.25; 5 -12.675,8.75; 6 -12.675,8.25; 7 -12.675,7.75; 8 -12.675,7.25; 9 -12.675,6.75; 10 -12.675,6.25; 11 -12.675,5.75; 12 -12.675,5.25; 13 -12.675,4.75; 14 -12.675,4.25; 15 -12.675,3.75; 16 -12.675,3.25; 17 -12.675,2.75; 18 -12.675,2.25; 19 -12.675,1.75; 20 -12.675,1.25; 21 -12.675,0.75; 22 -12.675,0.25; 23 -12.675,-0.25; 24 -12.675,-0.75; 25 -12.675,-1.25; 26 -12.675,-1.75; 27 -12.675,-2.25; 28 -12.675,-2.75; 29 -12.675,-3.25; 30 -12.675,-3.75; 31 -12.675,-4.25; 32 -12.675,-4.75; 33 -12.675,-5.25; 34 -12.675,-5.75; 35 -12.675,-6.25; 36 -12.675,-6.75; 37 -12.675,-7.25; 38 -12.675,-7.75; 39 -12.675,-8.25; 40 -12.675,-8.75; 41 -12.675,-9.25; 42 -12.675,-9.75; 43 -12.675,-10.25; 44 -12.675,-10.75; 89 12.675,-10.75; 90 12.675,-10.25; 91 12.675,-9.75; 92 12.675,-9.25; 93 12.675,-8.75; 94 12.675,-8.25; 95 12.675,-7.75; 96 12.675,-7.25; 97 12.675,-6.75; 98 12.675,-6.25; 99 12.675,-5.75; 100 12.675,-5.25; 101 12.675,-4.75; 102 12.675,-4.25; 103 12.675,-3.75; 104 12.675,-3.25; 105 12.675,-2.75; 106 12.675,-2.25; 107 12.675,-1.75; 108 12.675,-1.25; 109 12.675,-0.75; 110 12.675,-0.25; 111 12.675,0.25; 112 12.675,0.75; 113 12.675,1.25; 114 12.675,1.75; 115 12.675,2.25; 116 12.675,2.75; 117 12.675,3.25; 118 12.675,3.75; 119 12.675,4.25; 120 12.675,4.75; 121 12.675,5.25; 122 12.675,5.75; 123 12.675,6.25; 124 12.675,6.75; 125 12.675,7.25; 126 12.675,7.75; 127 12.675,8.25; 128 12.675,8.75; 129 12.675,9.25; 130 12.675,9.75; 131 12.675,10.25; 132 12.675,10.75 | smd 0.254 x 1.372: 45 -10.75,-12.675; 46 -10.25,-12.675; 47 -9.75,-12.675; 48 -9.25,-12.675; 49 -8.75,-12.675; 50 -8.25,-12.675; 51 -7.75,-12.675; 52 -7.25,-12.675; 53 -6.75,-12.675; 54 -6.25,-12.675; 55 -5.75,-12.675; 56 -5.25,-12.675; 57 -4.75,-12.675; 58 -4.25,-12.675; 59 -3.75,-12.675; 60 -3.25,-12.675; 61 -2.75,-12.675; 62 -2.25,-12.675; 63 -1.75,-12.675; 64 -1.25,-12.675; 65 -0.75,-12.675; 66 -0.25,-12.675; 67 0.25,-12.675; 68 0.75,-12.675; 69 1.25,-12.675; 70 1.75,-12.675; 71 2.25,-12.675; 72 2.75,-12.675; 73 3.25,-12.675; 74 3.75,-12.675; 75 4.25,-12.675; 76 4.75,-12.675; 77 5.25,-12.675; 78 5.75,-12.675; 79 6.25,-12.675; 80 6.75,-12.675; 81 7.25,-12.675; 82 7.75,-12.675; 83 8.25,-12.675; 84 8.75,-12.675; 85 9.25,-12.675; 86 9.75,-12.675; 87 10.25,-12.675; 88 10.75,-12.675; 133 10.75,12.675; 134 10.25,12.675; 135 9.75,12.675; 136 9.25,12.675; 137 8.75,12.675; 138 8.25,12.675; 139 7.75,12.675; 140 7.25,12.675; 141 6.75,12.675; 142 6.25,12.675; 143 5.75,12.675; 144 5.25,12.675; 145 4.75,12.675; 146 4.25,12.675; 147 3.75,12.675; 148 3.25,12.675; 149 2.75,12.675; 150 2.25,12.675; 151 1.75,12.675; 152 1.25,12.675; 153 0.75,12.675; 154 0.25,12.675; 155 -0.25,12.675; 156 -0.75,12.675; 157 -1.25,12.675; 158 -1.75,12.675; 159 -2.25,12.675; 160 -2.75,12.675; 161 -3.25,12.675; 162 -3.75,12.675; 163 -4.25,12.675; 164 -4.75,12.675; 165 -5.25,12.675; 166 -5.75,12.675; 167 -6.25,12.675; 168 -6.75,12.675; 169 -7.25,12.675; 170 -7.75,12.675; 171 -8.25,12.675; 172 -8.75,12.675; 173 -9.25,12.675; 174 -9.75,12.675; 175 -10.25,12.675; 176 -10.75,12.675
SMD_3225 = smd 1.6 x 1.4: 1 -1.2,-0.9; 2 1.2,-0.9; 3 1.2,0.9; 4 -1.2,0.9
SMD_X_2_PADS = smd 1.9 x 1.1: P$1 0,1.25; P$2 0,-1.25

### Placement (x,y rotation side)
C1  24.15,56.05 180 bottom
C2  25.15,56.06 180 bottom
C5  29.9,20.45 0 top
C8  28.8,20.45 0 top
C10  33.2,65.78 180 bottom
C11  28.3,15.1 270 top
C13  39.69,65.79 180 bottom
C14  26.97,65.78 180 bottom
C15  28.9,17.7 180 top
C16  45,8.4 270 top
C30  23.35,49.91 0 bottom
C31  43.9,54.35 90 bottom
C32  41.44,64.84 90 bottom
C33  7.5,22.35 90 bottom
C34  7.5,20.3 90 bottom
C35  7.5,21.3 90 bottom
C36  33.11,73.92 0 bottom
C37  23.62,60.14 90 bottom
C38  32.02,40.07 270 top
C39  16.56,7.07 0 bottom
C40  17.84,7.07 0 bottom
C41  15.91,29.37 0 bottom
C42  15.91,31.98 180 bottom
C43  18.46,24.48 0 bottom
C44  20.09,24.48 0 bottom
C45  21.12,24.48 0 bottom
C46  22.4,24.48 0 bottom
C47  21.76,31.46 90 bottom
C48  31.95,30 180 bottom
C49  30.6,30 180 bottom
C50  32.14,38.97 270 top
C51  35.03,40.07 90 top
C52  36.2,39.03 270 top
C53  38.13,39.5 180 top
C54  24.26,64.92 90 bottom
C55  23.13,56.04 180 bottom
C56  25.8,60.15 90 bottom
C57  44.28,57.85 0 bottom
C58  34.76,47.99 180 bottom
C59  42.66,57.24 270 bottom
C60  39.09,47.95 180 bottom
C61  42.29,47.94 0 bottom
FB2/2  16.22,24.33 90 bottom
J1  4,22 270 top
J2  47,1.7 0 top
J3  35,7.4 90 top
J4  17.2,19.8 0 top
J5  4.1,39.1 270 top
J6  54,20 270 top
J7  55,43 270 top
J9  2.8,69 270 top
J10  30,83 0 top
J11  54,75 270 top
J12  3.1,54.9 0 top
L3  8,17.8 270 bottom
LED3  10.8,24.8 270 top
R1  33.6,22.7 270 top
R4  45.6,10.4 0 top
R5  46.7,10.4 0 top
R6  47.7,10.4 0 top
R7  45,7.3 90 top
R12  31.6,21.2 270 top
R13  8.12,24.09 0 top
R16  43.89,56.28 270 bottom
R17  43.88,55.32 270 bottom
R18  42.58,58.42 90 bottom
R19  36.31,42.5 270 top
R20  22.15,67.08 180 bottom
R21  23.13,67.08 180 bottom
R23  23.89,3.88 0 bottom
R24  10.54,3.83 0 bottom
R25  21.78,32.46 270 bottom
R26  26.16,56.07 180 bottom
R27  24.54,48.72 180 bottom
R28  21.83,34.41 90 bottom
R29  21.78,33.44 90 bottom
R30  27.95,30.55 0 bottom
R31  29.6,29.95 0 bottom
R32  30.95,24.6 90 bottom
R33  31.6,26.9 90 bottom
U2  33.2,18.5 270 top
U3  26.4,26.55 180 bottom
U4  33.3,56.7 90 top
U5  12.85,30.81 270 bottom
U$4  25.61,48.7 180 bottom
X3  32.1,37.26 90 top
X4  37.31,35.89 0 top

### Tracks (layer width: path | path; a pad name or v marks a point on that pad's centre or on a via)
C58
  Bottom 0.254: J4.4 16.57,7.4 C39.P$1
C60
  Bottom 0.254: J4.5 17.84,7.4 C40.P$1
CRS_DV
  Bottom 0.254: U3.15 30.9,26.8 R33.P$2
D+
  Top 0.406: R6.P$2 47.7,9.07 47,8.27 J2.P$3
D-
  Top 0.406: R5.P$2 46.7,8.8 46.35,8.45 J2.P$2
ETH  (via drill 0.35)
  Top 0.254: v30.95,25.75 28.15,25.75 26.55,27.35 U4.9
  Bottom 0.254: U3.16 30.4,26.3 v30.95,25.75
ETH_CRS_DV  (via drill 0.35)
  Top 0.254: v32,28.25 32,31.4 28.55,34.85 U4.13
  Bottom 0.254: v32,28.25 32.05,28.25 32.2,28.1 R33.P$1
ETH_IRQ14  (via drill 0.35)
  Top 0.254: v18.55,32.8 19.8,32.8 20.1,32.5 20.1,22 20.55,21.55 27.25,21.55 28.65,22.95 29.35,22.95 29.45,23.05 v29.45,24.6 | U4.159 18.55,54.45 v18.3,54.7
  Bottom 0.254: v18.55,32.8 18.35,32.8 16.9,34.25 16.9,53.3 v18.3,54.7 18.8,54.2 25.59,54.2 26.16,54.77 R26.P$1 | U3.18 29.1,25.3 29.45,24.95 v29.45,24.6
ETH_MDC  (via drill 0.35)
  Top 0.254: U4.4 24.05,34.86 v23.6,34.41
  Bottom 0.254: U3.11 27.15,32.25 24.99,34.41 v23.6,34.41 R28.P$1
ETH_MDIO  (via drill 0.35)
  Top 0.254: U4.5 24.55,33.6 v24.39,33.44
  Bottom 0.254: U3.10 26.65,31.3 24.51,33.44 v24.39,33.44 R29.P$1
ETH_RESET  (via drill 0.35)
  Top 0.254: v22.85,22.3 20.85,22.3 20.55,22.6 20.55,32.65 19.5,33.7 v19.25,33.7 | U4.172 17.85,47.95 v17.6,48.2
  Bottom 0.254: U3.24 25.15,24.25 23.2,22.3 v22.85,22.3 | U$4.P$1 24.56,48.1 R27.P$1 24.37,47.95 17.85,47.95 v17.6,48.2 17.35,47.95 17.35,34.7 18.35,33.7 v19.25,33.7
ETH_RX_ER  (via drill 0.35)
  Top 0.254: v32,25.8 31.26,26.54 31.26,31.47 28.05,34.68 U4.12
  Bottom 0.254: R32.P$1 32,25.05 v32,25.8
ETH_RXD0  (via drill 0.35)
  Top 0.254: v28.95,31.7 27.85,31.7 27.05,32.5 U4.10
  Bottom 0.254: v28.95,31.7 29.6,31.05 R31.P$1
ETH_RXD1  (via drill 0.35)
  Top 0.254: U4.11 27.55,33.58 27.8,33.25 v27.8,33.2
  Bottom 0.254: R30.P$1 27.8,31.3 v27.8,33.2
ETH_TXD0  (via drill 0.35)
  Top 0.254: v27.25,23.1 27.25,26 26.05,27.2 U4.8
  Bottom 0.254: U3.20 27.15,23.2 v27.25,23.1
ETH_TXD1  (via drill 0.35)
  Top 0.254: v26.4,23.45 26.4,26.05 25.55,26.9 U4.7
  Bottom 0.254: U3.21 26.65,23.7 v26.4,23.45
ETH_TXD_EN  (via drill 0.35)
  Top 0.254: v28.55,23.65 28.55,23.45 27.5,22.4 26.42,22.4 25.61,23.21 25.61,25.94 25.05,26.5 U4.6
  Bottom 0.254: U3.19 27.65,23.98 27.98,23.65 v28.55,23.65
GND  (via drill 0.35)  (103 unrouted)
  Bottom 0.254: v33.1,75.9 C36.P$1
  other vias: 19.4,55.7 13,23.6 34.7,31.3 40.3,24.7 40.2,31.1 14.1,44.5 19.9,44.5 8.5,61.3 45.9,18.6 36.6,46 35.3,55.6 26.5,53.2 27.1,62.9
  pour Top (no thermals): 0,86.5 60,86.5 60,0.1 0,0.1
  pour Bottom (no thermals): 0,86.5 60,86.5 60,0.1 0,0.1
GNDE  (via drill 0.35)  (2 unrouted)
  Top 0.254: J9.S3 2.38,63.02 J9.S1 2.1,63.3 v2.1,61.7 1.14,60.74 1.14,12.2 2.77,10.57 J1.P$4 | J9.S4 2.3,74.95 J9.S2 2.05,75.95 v2,76
  Top 0.813: J2.P$9 50.52,3.95 J2.P$7
  Top 1.016: J2.P$9 J2.P$8 43.48,4.38 J2.P$6 42.33,4.38 41.57,5.13 J3.SHLD1 | J3.SHLD2 28.51,10.4 J4.14
  Bottom 0.254: v2,76 2,61.8 v2.1,61.7
  Bottom 1.016: J1.P$4 6.06,10.57 J4.13
IIC_1_SCL  (via drill 0.35)
  Top 0.254: U4.132 22.55,70.19 v21.85,70.88 20.87,70.88 12.05,79.7 11.5,79.7 10.95,80.25 J10.P$5
  Bottom 0.254: R20.P$2 22.15,70.58 v21.85,70.88
IIC_1_SDA  (via drill 0.35)
  Top 0.254: U4.131 23.05,70.97 v22.33,71.69 20.93,71.69 12.3,80.32 12.3,82.92 J10.P$6
  Bottom 0.254: v22.33,71.69 23.03,70.98 23.03,67.78 R21.P$2
INT_MI_01  (via drill 0.35)
  Top 0.254: J10.P$39 50.86,78.46 v50.86,75.74 | U4.87 47.38,66.95 48.62,68.19 v49.7,68.19
  Bottom 0.254: v50.86,75.74 49.66,74.54 49.66,68.23 v49.7,68.19
INT_MI_02  (via drill 0.35)
  Top 0.254: U4.86 48.05,66.45 v48.9,67.3 | J10.P$40 54.19,84.27 55.6,82.86 55.6,81.4 51.6,77.4 v51.6,76.4
  Bottom 0.254: v48.9,67.3 48.9,74.8 50.5,76.4 v51.6,76.4
INT_MI_03
  Top 0.254: U4.128 24.55,72.15 16.03,80.67 J10.P$9
INT_MI_04
  Top 0.254: J10.P$10 17.33,82.97 17.33,80.09 25.05,72.37 U4.127
LED1/SPEED
  Bottom 0.254: U3.23 25.65,24.1 23.6,22.05 23.6,17.33 19.49,13.22 19.49,7.72 J4.11
N$1  (via drill 0.35)
  Top 0.254: U4.148 18.5,59.95 v17.8,59.25
  Bottom 0.254: v17.8,59.25 18.5,59.95 22.83,59.95 C37.P$2
N$3
  Top 0.508: R13.P$1 8.12,24.89 8.98,25.75 LED3.1
N$4
  Top 0.254: C38.P$1 32.62,40.97 31.55,42.05 U4.19
N$5  (via drill 0.35)
  Top 0.254: v47.95,54.5 47.9,54.45 U4.62
  Bottom 0.254: v47.95,54.5 47.9,54.45 44.6,54.45 C31.P$1
N$6  (via drill 0.35)
  Top 0.254: v48,55.5 47.95,55.45 U4.64
  Bottom 0.254: v48,55.5 47.95,55.45 44.6,55.44 R17.P$2
N$7  (via drill 0.35)
  Top 0.254: v48.3,56.4 47.92,56.4 47.48,55.95 U4.65
  Bottom 0.254: v48.3,56.4 47.9,56.4 47.52,56.02 45.54,56.02 45.29,56.27 R16.P$2
N$8
  Top 0.254: U4.27 35.55,42.69 35.54,42.67 R19.P$2
P0_00
  Top 0.254: U4.169 8.14,49.45 7.08,50.51 5.39,50.51 J5.P$2
P0_01
  Top 0.254: J5.P$1 2.83,50.55 3.99,51.71 6.95,51.71 8.71,49.95 U4.168
P0_02
  Top 0.254: U4.167 8.95,50.45 7.1,52.3 4.3,52.3 3.1,53.5 J12.1
P0_03
  Top 0.254: U4.166 9.15,50.95 7.3,52.8 6.3,52.8 5.64,53.46 J12.3
P0_04
  Top 0.254: U4.165 10.05,51.45 8.18,53.32 J12.5
P0_05
  Top 0.254: U4.164 12.25,51.95 10.72,53.48 J12.7
P0_06
  Top 0.254: U4.163 14.25,52.45 13.26,53.44 J12.9
P0_07
  Top 0.254: U4.162 16.15,52.95 14.6,54.5 14.6,56.2 13.36,57.44 J12.10
P0_08
  Top 0.254: U4.161 17.05,53.45 15.3,55.2 15.3,57.6 14.2,58.7 11.2,58.7 10.72,58.22 J12.8
P0_09
  Top 0.254: U4.160 17.75,53.95 15.8,55.9 15.8,57.9 14.5,59.2 8.9,59.2 8.18,58.48 J12.6
P0_14
  Top 0.254: U4.152 16.45,57.95 14.79,59.61 7.81,59.61 J12.4
P0_15
  Top 0.254: U4.151 16.95,58.45 15.3,60.1 4.3,60.1 3.1,58.9 J12.2
P1_02
  Top 0.254: U4.130 23.55,71.65 13.49,81.71 J10.P$7
P1_03
  Top 0.254: J10.P$8 14.72,83.04 14.72,81.2 24.06,71.87 24.06,69.38 U4.129
P1_06
  Top 0.254: U4.126 25.55,72.6 18.57,79.58 J10.P$11
P1_07
  Top 0.254: J10.P$12 18.6,84.27 19.8,83.07 19.8,79.07 26.05,72.82 U4.125
P1_11
  Top 0.254: U4.92 42.55,71.05 52.7,81.2 52.7,83.26 51.69,84.27 J10.P$38
P1_12
  Top 0.254: U4.93 42.05,71.15 51.59,80.69 J10.P$37
P1_13
  Top 0.254: U4.94 41.55,71.35 50.4,80.2 50.4,82.92 J10.P$36
P1_14
  Top 0.254: U4.95 41.05,71.45 49.05,79.45 J10.P$35
P1_15
  Top 0.254: U4.96 40.55,70.42 40.56,70.43 40.56,71.56 47.7,78.7 47.7,83.08 J10.P$34
P2_00  (via drill 0.35)
  Top 0.254: U4.69 48.46,57.95 49.41,57 49.41,56.2 v49.66,55.95
  Bottom 0.254: v49.66,55.95 50.75,54.86 50.75,40.45 52.01,39.19 J7.P$13
P2_01  (via drill 0.35)
  Top 0.254: U4.68 47.07,57.45 47.08,57.46 48.37,57.46 48.96,56.87 48.96,55.7 v49.66,55
  Bottom 0.254: v49.66,55 50.3,54.36 50.3,39.6 52,37.9 55,37.9 56.27,39.17 J7.P$14
P2_02
  Top 0.254: U4.54 48.3,50.45 50.73,48.02 50.73,33.07 52.23,31.57 J7.P$19
P2_03
  Top 0.254: U4.53 48.22,49.95 50.32,47.86 50.32,21.18 51.5,20 J6.1
P2_04
  Top 0.254: U4.52 48.1,49.45 49.91,47.64 49.91,18.8 51.25,17.46 J6.3
P2_05
  Top 0.254: U4.51 47.95,48.95 49.5,47.4 49.5,16.2 50.78,14.92 J6.5
P2_06
  Top 0.254: U4.50 47.83,48.45 49.05,47.23 49.05,13.75 50.42,12.38 J6.7
P2_07
  Top 0.254: U4.49 47.7,47.95 48.6,47.05 48.6,11.7 50.5,9.8 53.96,9.8 J6.9
P3_03
  Top 0.254: U4.85 50.93,65.95 53.73,63.15 53.73,58.47 56.27,55.93 J7.P$2
P3_04
  Top 0.254: U4.82 51.85,64.45 53.33,62.98 53.33,58.17 55.1,56.4 55.1,53.06 J7.P$4
P3_05  (via drill 0.35)
  Top 0.254: U4.81 45.98,63.96 51.77,63.96 52.92,62.81 52.92,57.18 v53.4,56.7
  Bottom 0.254: v53.4,56.7 55.1,55 55.1,50.52 J7.P$6
P3_06
  Top 0.254: U4.80 51.7,63.45 52.51,62.64 52.51,55.65 J7.P$1
P3_07
  Top 0.254: U4.79 51.63,62.95 52.11,62.47 52.11,52.69 52.91,51.89 J7.P$3
P3_09
  Top 0.254: U4.77 50.74,61.95 51.7,60.99 51.7,50 52.4,49.3 53.68,49.3 J7.P$5
P3_10  (via drill 0.35)
  Top 0.254: U4.76 50.25,61.45 v50.64,61.06
  Bottom 0.254: v50.64,61.06 51.04,61.06 52.46,59.64 52.46,47.8 53.45,46.81 J7.P$7
P3_11  (via drill 0.35)
  Top 0.254: v50.95,60.15 50.5,60.15 49.7,60.95 U4.75
  Bottom 0.254: v50.95,60.15 52.06,59.05 52.06,46.54 53,45.6 55.06,45.6 J7.P$8
P3_12
  Top 0.254: J7.P$9 53.34,44.27 52.41,45.2 52.41,48.7 51.21,49.9 51.21,58.87 49.62,60.45 U4.74
P3_13
  Top 0.254: U4.55 48.38,50.95 51.19,48.13 51.19,34.11 52.5,32.8 55.04,32.8 J7.P$20
P3_14
  Top 0.254: U4.56 48.45,51.45 51.6,48.3 51.6,34.8 52.29,34.11 J7.P$17
P3_15  (via drill 0.35)
  Top 0.254: v48.78,52.08 48.65,51.95 U4.57
  Bottom 0.254: v48.78,52.08 48.78,52.14 48.85,52.21 48.85,36.5 52.45,32.9 55.06,32.9 J7.P$18
P4_00
  Top 0.254: U4.1 22.55,43.25 22.3,43 8.1,43 7,44.1 4.02,44.1 J5.P$7
P4_01
  Top 0.254: U4.2 23.05,43.05 22.4,42.4 5.88,42.4 J5.P$8
P4_02
  Top 0.254: U4.3 23.55,42.95 22.2,41.6 4.06,41.6 J5.P$9
P4_08  (via drill 0.35)
  Top 0.254: U4.43 43.55,36.2 v43.35,36 | v20.2,34.5 19.1,34.5 13.2,28.6 6.3,28.6 J5.P$20
  Bottom 0.254: v43.35,36 43.35,35.95 42.94,35.54 21.19,35.54 20.2,34.55 v20.2,34.5
P4_09  (via drill 0.35)
  Top 0.254: J5.P$19 4.26,29.1 13.07,29.1 19.09,35.12 19.84,35.12 v20.18,35.47 | U4.42 43.05,37.11 v42.85,36.91
  Bottom 0.254: v42.85,36.91 42.5,36.91 41.54,35.95 20.67,35.95 v20.18,35.47
P4_10  (via drill 0.35)
  Top 0.254: U4.41 42.55,37.98 v42.39,37.82 | v18.08,35.1 13.2,30.21 J5.P$18
  Bottom 0.254: v42.39,37.82 40.94,36.37 20.11,36.37 18.84,35.1 v18.08,35.1
P4_11  (via drill 0.35)
  Top 0.254: U4.40 42.05,38.56 v41.8,38.56 | v18.01,36.2 13.31,31.5 4.12,31.5 J5.P$17
  Bottom 0.254: v41.8,38.56 41.75,38.56 39.99,36.8 19.81,36.8 19.21,36.2 v18.01,36.2
P4_12  (via drill 0.35)
  Top 0.254: J5.P$16 13.45,32.75 17.76,37.06 v18.8,37.06 | v41.39,39.5 41.55,39.5 U4.39
  Bottom 0.254: v41.39,39.5 39.15,37.26 19,37.26 v18.8,37.06
P4_13  (via drill 0.35)
  Top 0.254: U4.38 41.05,40.69 40.86,40.5 v40.86,40.3 | v18.03,37.87 17.7,37.87 13.93,34.1 4.18,34.1 J5.P$15
  Bottom 0.254: v40.86,40.3 38.27,37.72 18.18,37.72 v18.03,37.87
P4_14  (via drill 0.35)
  Top 0.254: J5.P$14 14.29,35.29 17.53,38.53 18.5,38.53 18.63,38.4 v19.2,38.4 | v40.09,40.99 40.55,41.45 U4.37
  Bottom 0.254: v19.2,38.4 19.45,38.15 37.26,38.15 v40.09,40.99
P4_15  (via drill 0.35)
  Top 0.254: U4.36 40.05,42.18 v39.76,41.89 | v18.3,39.2 17.4,39.2 14.9,36.7 4.24,36.7 J5.P$13
  Bottom 0.254: v39.76,41.89 39.76,41.69 36.68,38.61 20.12,38.61 19.67,39.06 18.44,39.06 v18.3,39.2
P5_11
  Top 0.254: U4.176 5.95,45.95 5.41,45.41 J5.P$6
P5_12
  Top 0.254: U4.175 5.83,46.45 5.8,46.48 3.86,46.48 J5.P$5
P5_13
  Top 0.254: U4.174 6.41,46.95 J5.P$4
P6_00
  Top 0.254: U4.122 27.55,72 21.11,78.44 J10.P$13
P6_01
  Top 0.254: J10.P$14 22.42,82.96 22.42,77.81 28.05,72.17 U4.121
P6_02
  Top 0.254: U4.120 28.55,72.35 23.65,77.25 J10.P$15
P6_03
  Top 0.254: J10.P$16 24.9,83.02 24.9,76.68 29.05,72.53 U4.119
P6_04
  Top 0.254: U4.118 29.55,72.75 26.19,76.11 J10.P$17
P6_05
  Top 0.254: J10.P$18 26.19,84.2 27.52,82.87 27.52,75.43 30.05,72.9 U4.117
P6_06
  Top 0.254: U4.116 30.55,73.15 28.73,74.97 J10.P$19
P6_07
  Top 0.254: J10.P$20 30.01,82.99 30.01,74.49 31.05,73.45 U4.115
P6_08
  Top 0.254: U4.99 39.05,70.9 46.51,78.36 J10.P$33
P6_09
  Top 0.254: U4.100 38.55,71.05 45.2,77.7 45.2,83.08 45.18,83.06 J10.P$32
P6_10
  Top 0.254: U4.101 38.05,71.15 43.97,77.07 J10.P$31
P6_11
  Top 0.254: J10.P$30 42.73,82.97 42.76,82.99 42.76,76.46 37.55,71.25 U4.102
P6_12
  Top 0.254: U4.103 37.05,71.35 41.43,75.73 J10.P$29
P6_13
  Top 0.254: J10.P$28 40.2,82.96 40.2,75.1 36.55,71.45 U4.104
P6_14
  Top 0.254: U4.105 36.05,71.55 38.89,74.39 J10.P$27
P6_15
  Top 0.254: U4.106 35.55,71.65 37.65,73.75 37.65,82.9 37.7,82.92 J10.P$26
P7_06  (via drill 0.35)
  Top 0.254: U4.14 29.05,41.41 v29.21,41.25 | v18.6,40.92 17.12,40.92 16.6,40.4 5.4,40.4 J5.P$10
  Bottom 0.254: v29.21,41.25 18.93,41.25 v18.6,40.92
P7_07  (via drill 0.35)
  Top 0.254: U4.15 29.55,42.7 29.88,42.37 29.88,40.84 29.32,40.28 v29.22,40.28 | v19.3,40.3 19.26,40.26 17.16,40.26 16.1,39.2 4.2,39.2 J5.P$11
  Bottom 0.254: v29.22,40.28 29.2,40.3 v19.3,40.3
P8_00
  Top 0.254: U4.133 19.73,67.45 18.73,68.45 18.73,72.22 11.84,79.1 10.4,79.1 9.74,79.76 9.74,82.96 8.43,84.27 J10.P$4
P8_01
  Top 0.254: U4.134 19.52,66.95 18.18,68.3 18.18,72.1 11.62,78.66 9.54,78.66 8.41,79.79 J10.P$3
P8_02
  Top 0.254: J10.P$2 5.87,84.23 7,83.1 7,79.9 8.65,78.25 11.45,78.25 17.62,72.08 17.62,68.25 19.43,66.45 U4.135
P8_03  (via drill 0.35)
  Top 0.254: U4.136 18.95,65.95 v18.45,66.45
P8_04  (via drill 0.35)
  Top 0.254: U4.137 18.51,65.45 v17.5,66.46
P8_05
  Top 0.254: U4.173 8.05,47.45 6.2,49.3 4.14,49.3 J5.P$3
P9_00  (via drill 0.35)
  Top 0.254: v48.99,53.35 48.09,52.45 U4.58
  Bottom 0.254: v48.99,53.35 49.04,53.35 49.44,52.95 49.44,38.36 52.5,35.3 54.92,35.3 J7.P$16
P9_01  (via drill 0.35)
  Top 0.254: v49.59,54.05 48.74,54.05 47.64,52.95 U4.59
  Bottom 0.254: v49.59,54.05 49.85,53.79 49.85,38.95 52.15,36.65 J7.P$15
P9_05
  Top 0.254: U4.73 49.55,59.95 50.8,58.7 50.8,49.7 52,48.5 52,44 53.1,42.9 54.9,42.9 J7.P$10
P9_06  (via drill 0.35)
  Top 0.254: U4.72 45.98,59.46 48.97,59.46 v50.06,58.37
  Bottom 0.254: v50.06,58.37 51.65,56.78 51.65,42.75 52.67,41.73 J7.P$11
P9_07  (via drill 0.35)
  Top 0.254: U4.71 48.4,58.95 50.1,57.25 v50.1,56.8
  Bottom 0.254: v50.1,56.8 51.2,55.7 51.2,46.5 51.21,46.51 51.21,41.05 51.86,40.4 54.94,40.4 J7.P$12
PA_00
  Top 0.254: J10.P$21 31.27,73.95 31.55,73.67 U4.114
PA_01
  Top 0.254: J10.P$22 31.27,84.26 32.4,83.13 32.4,74.18 32.04,73.82 32.04,69.72 32.05,69.71 U4.113
PA_08
  Top 0.254: J10.P$25 36.35,73.08 35.05,71.78 U4.107
PA_09
  Top 0.254: J10.P$24 35.04,83.04 35.04,72.4 34.55,71.91 U4.108
PA_10
  Top 0.254: U4.109 34.05,80.79 34.13,81.41 J10.P$23
PB_00  (via drill 0.35)
  Top 0.254: J5.P$12 15.43,37.83 17.46,39.86 18.57,39.86 18.87,39.56 v20.1,39.56 | v29.21,39.29 30.3,40.38 30.3,42.58 30.05,42.83 U4.16
  Bottom 0.254: v20.1,39.56 28.53,39.56 28.81,39.29 v29.21,39.29
R51
  Bottom 0.254: R23.P$1 23.89,5.86 J4.12
R52
  Bottom 0.254: J4.9 10.54,5.89 R24.P$1
RESET  (via drill 0.35)
  Top 0.254: v47.35,56.8 47.2,56.95 U4.67
  Bottom 0.254: J11.9 52.1,64.84 46.9,59.64 46.9,58.45 C57.P$1 | v47.35,56.8 47.35,57.9 46.8,58.45 C57.P$1 | C57.P$1 43.21,58.45 R18.P$1
REXT
  Bottom 0.254: U3.9 26.15,30.71 25.18,31.46 C47.P$1 22.38,31.48 R25.P$2
RXD0
  Bottom 0.254: R31.P$2 29.6,28.23 29.17,27.8 U3.13
RXD1
  Bottom 0.254: U3.12 27.65,29.1 27.95,29.4 R30.P$2
RXER
  Bottom 0.254: U3.17 29.75,25.8 30.35,25.2 R32.P$2
RXM
  Bottom 0.254: J4.6 18.01,20.9 15.25,20.9 14.8,21.35 14.8,25.75 15.35,26.3 U3.3
RXP
  Bottom 0.254: U3.4 14.95,26.8 14.19,26.04 14.19,21.26 15.29,20.16 J4.3
SD1_CD
  Top 0.254: U4.146 16.25,60.95 13.78,63.42 13.78,64.04 13.7,64.12 13.7,73.8 12.88,74.62 J9.10
SD1_CLK  (via drill 0.35)
  Top 0.254: v16.8,70.1 16.75,70.05 16.75,65.32 18.13,63.94 20.62,63.94 U4.140 | v4.8,70.2 J9.5
  Bottom 0.254: v16.8,70.1 4.9,70.1 v4.8,70.2
SD1_CMD  (via drill 0.35)
  Top 0.254: v16.09,68 16.09,65.4 18.05,63.45 U4.141 | v4.6,68 J9.3
  Bottom 0.254: v16.09,68 v4.6,68
SD1_DAT0  (via drill 0.35)  (1 unrouted)
  Top 0.254: 20.38,62.95 20.37,62.94 | 17.98,62.94 17.97,62.95 | v15.4,72.3 15.4,65.52 17.81,63.11 17.97,62.95 | v4.8,72.4 J9.7 | U4.142 17.97,62.95
  Bottom 0.254: v15.4,72.3 4.9,72.3 v4.8,72.4
SD1_DAT1  (via drill 0.35)
  Top 0.254: v14.7,73.5 14.7,65.65 17.77,62.57 17.9,62.45 U4.143 | v4.8,73.5 J9.8
  Bottom 0.254: v14.7,73.5 v4.8,73.5
SD1_DAT2  (via drill 0.35)
  Top 0.254: U4.144 17.47,61.95 v15.21,64.21 | v4.4,65.8 J9.1
  Bottom 0.254: v15.21,64.21 13.62,65.8 v4.4,65.8
SD1_DAT3  (via drill 0.35)
  Top 0.254: U4.145 17.04,61.45 v15.94,62.54 | v4.5,66.9 J9.2
  Bottom 0.254: v15.94,62.54 15.87,62.62 15.87,64.48 13.45,66.9 v4.5,66.9
SD1_WP
  Top 0.254: U4.147 15.75,60.45 12.78,63.42 J9.9
TCK
  Top 0.254: J11.7 52.53,68.85 48.38,68.85 46.98,67.45 U4.88
TDI
  Top 0.254: U4.91 43.05,70.65 45.5,73.1 52.1,73.1 J11.1
TDO
  Top 0.254: U4.90 43.54,69.38 43.54,70.48 45.53,72.46 J11.3
TMS
  Top 0.254: U4.89 44.05,70.28 45.49,71.72 52.2,71.72 J11.5
TXM
  Bottom 0.254: U3.5 13.05,27.3 11.7,25.95 11.7,22.1 14,19.8 J4.2
TXP
  Bottom 0.254: U3.6 12.65,27.8 11,26.15 11,19.01 J4.1
USB_N
  Top 0.254: R5.P$1 46.7,12 47.7,13 47.7,46 47.25,46.45 U4.46
USB_P
  Top 0.254: R6.P$1 47.7,11.95 48.17,12.43 48.17,46.4 47.62,46.95 U4.47
USB_VBUS_B
  Top 0.254: U4.44 44.05,14.05 45.6,12.5 R4.P$1
USBHS_FAULT  (via drill 0.35)
  Top 0.254: U2.3 32.2,19.8 R12.P$1 32.77,21.77 v33.4,21.77 | U4.78 51.2,62.45 v51.45,62.2
  Bottom 0.254: v33.4,21.77 46.1,21.77 48.4,24.07 48.4,47.1 48.1,47.4 48.1,52.7 48.2,52.8 48.2,53.6 49,54.4 49,60.5 50.7,62.2 v51.45,62.2
USBHS_N
  Top 0.254: J3.D- 34,15.4 35.4,16.8 35.4,29.05 40.25,33.9 40.25,39.15 37.55,41.85 U4.31
USBHS_P
  Top 0.254: J3.D+ 36,29.05 40.7,33.75 40.7,39.35 38.05,42 U4.32
USBHS_VBUS  (via drill 0.35)  (2 unrouted)
  Top 0.254: U2.5 32.65,15.76 32.65,14.76 32,14.1 J3.VBUS 31.5,15.11 C11.P$1 28.9,15 | 30.4,15.3 30.4,17.6 C15.1 | v30.35,23.65 30.95,23.65 32.7,25.4 32.7,31.5 29,35.2 29,38.15 30.75,39.9 30.75,42.83 30.55,43.02 U4.17
  Top 0.508: U2.5 34.2,17.2
  Bottom 0.254: v30.35,23.65 30.4,23.6 v30.4,15.1
USBHS_VBUSEN
  Top 0.254: R1.P$1 34.2,19.8 U2.1
VBUS
  Top 0.4: R4.P$2 C16.P$1
  Top 0.406: J2.P$1 45.6,4.28 R7.P$2 C16.P$1
VCL_F(FLASH)  (via drill 0.35)
  Top 0.254: U4.112 32.55,72.05 v32.9,72.4
  Bottom 0.254: C36.P$2 33.01,73.22 33.01,72.41 33,72.4 v32.9,72.4
VDD  (via drill 0.35)  (3 unrouted)
  Top 0.254: U4.171 18.91,48.45 v18.75,48.61 | U4.48 44.25,47.45 v43.8,47.9 | U4.84 48.25,65.45 v48.5,65.2 | v39.9,70.7 40.05,70.55 U4.97 | U4.110 33.55,71.05 v33.25,71.35 | U4.149 19.2,59.45 v19,59.25 | U4.155 18.95,56.45 v18.8,56.6 | U4.154 19.15,56.95 v18.8,56.6 | v18.8,56.6 18.7,56.5 18.7,55.38 19.12,54.95 U4.158 | U4.34 39.05,42.7 v38.95,42.6 | U4.25 34.55,42.75 v34.8,42.5 | v34.8,42.5 | U4.26 35.05,42.75 v34.8,42.5 | v34.8,42.5 | U4.138 18.05,64.95 v17.45,65.55 | v47.4,53.75 47.2,53.95 U4.61 | U4.123 27.05,70.85 v26.8,71.1
  Top 0.406: v16.2,22.26 17.4,21.06 19.4,21.06 19.4,21.07 | v32.8,24.3 30.8,22.3 28.7,22.3 27.47,21.07 19.4,21.07 | v19.4,32 19.4,21.07
  Top 0.508: v16.2,22.26 16.15,22.21 10,22.21 9.4,22.81 v9.4,23 8.91,23.49 R13.P$2 | 19.4,24.46 v19.4,32 | v4.7,69.1 J9.4
  Bottom 0.152: U3.14 28.39,27.28
  Bottom 0.254: R23.P$2 23.93,3.31 23.92,3.05 | U3.14 30.05,27.3 30.6,27.85 C49.P$1 | v18.75,48.61 22.65,48.61 C30.P$2 R27.P$2 | v48.5,65.2 42.2,65.2 42.04,65.04 C32.P$1 | v19,59.25 19.2,59.45 24.9,59.45 25.2,59.75 C56.P$2 25.2,58.1 | v18.8,56.6 18.84,56.64 C55.P$2 24.14,56.64 C1.P$2 C2.P$2 25.16,56.67 R26.P$2 | C14.P$2 27.07,66.48 27.07,70.83 v26.8,71.1 | v17.45,65.55 17.47,65.57 23.01,65.57 C54.P$2 23.66,66.43 23.6,66.48 | v39.9,70.7 39.9,66.6 C13.P$2 | C58.P$1 34.8,47.35 v34.8,42.5 | C60.P$1 39.05,47.31 39.05,42.7 v38.95,42.6 | 42.39,47.44 C61.P$2 | C59.P$1 41.98,57.31 R18.P$2 | C10.P$2 33.25,66.43 v33.25,71.35
  Bottom 0.406: v32.8,24.3 33.11,24.61 33.11,28.89 32.65,29.35 32.6,29.4 C48.P$1
  Bottom 0.508: 16.2,22.15 16.22,22.17 FB2/2.1 | v19.4,32 19.4,32.2 20.64,33.44 R29.P$2 21.23,33.49 R28.P$2 | C34.P$1 8.2,20.4 9.1,20.4 | C35.P$1 8.2,21.4 9.1,21.4 | C33.P$1 9.05,22.35 9.1,22.3 | R24.P$2 15.2,3.23 | 15.2,3.23 23.84,3.23 23.93,3.31 | 15.2,3.23 15.2,12.42 12.92,14.7 12.2,14.7 L3.2 | 41.2,66.39 C13.P$2 C10.P$2 30.6,66.38 C14.P$2 26.86,66.48 23.6,66.48 R21.P$1 R20.P$1 20.92,66.48 18.3,69.1 v4.7,69.1 | 41.21,66.39 42.04,65.56 C32.P$1 41.98,64.79 R18.P$2 41.98,58.52 42.04,58.58 | C59.P$1 42.15,57.15 | C58.P$1 34.8,47.35 C60.P$1 39.11,47.34 C61.P$2 43.24,47.34 v43.8,47.9 45.2,47.9 47.4,50.1 v47.4,53.75 | R26.P$2 26.16,58.04 26.1,58.1 | R27.P$2 24.54,50.44 25.5,51.4 28,51.4 29.4,52.8 29.4,58.1 | C49.P$1 C48.P$1
  Bottom 0.813: L3.2 9.1,20.4 9.1,21.4 9.1,22.3 9.1,22.7 v9.4,23 | C61.P$2 45.1,44.52 45.1,33.4 41.05,29.35 32.65,29.35 | J11.4 J11.2 54.14,77.4 48.8,77.4 41.2,69.8 41.2,66.39
  Bottom 1.016: 25.2,58.1 26.1,58.1 29.4,58.1 30.6,59.3 30.6,66.38
VDD5  (via drill 0.35)
  Top 0.254: C8.P$1 28.9,21.05 | C5.P$1 30.85,21.05 R12.P$2 31,21.4 32.3,22.7 R1.P$2
  Top 0.508: U2.4 31.51,18 31.51,19.22 31,19.73 R12.P$2 | J1.P$3 6.3,14.38 8.1,12.58 v8.1,2 | C5.P$1 C8.P$1 28.65,21.05 v27.6,20
  Bottom 0.508: v8.1,2 8.12,2.02 25.7,2.02 26.3,2.62 26.3,11.4 27.6,12.7 v27.6,20
VDD_1.2
  Bottom 0.254: U3.1 22.62,25.3 C46.P$1 C45.P$1
VDD_ENET1
  Bottom 0.254: U3.2 20.39,25.8 20.09,25.5 C44.P$1 C43.P$1 18.39,25.01 16.32,25.01
  Bottom 0.508: C43.P$1 18.36,25.06 | 16.32,25.01 FB2/2.2
VDDIN
  Bottom 0.813: 6.82,17.88 L3.1
  Bottom 1.016: J1.P$2 6.51,18.19 6.82,17.88
XCIN
  Top 0.254: X3.P$1 31.55,37.26 32.04,37.75 32.04,38.27 C50.P$1 33.35,39.58 33.35,40.92 32.05,42.23 U4.20
XCOUT
  Top 0.254: U4.21 32.55,42.51 34.03,41.02 34.03,40.48 C51.P$1 34.43,38.34 X3.P$2
XII  (1 unrouted)
  Bottom 0.254: U3.8 25.65,30.3 25.17,30.78 20.69,30.78 20.68,30.8 18.1,30.8 17.5,31.4 15.93,31.4 | U5.1 14.41,31.35 15.88,31.35 C42.P$1
XOO
  Bottom 0.254: U3.7 25.15,29.72 24.67,30.2 16.14,30.2 C41.P$1 15.91,30.09 15.2,30.8 12.24,30.8 11.95,30.5 U5.3
XTAL1
  Top 0.254: X4.1 36.54,34.99 37.3,35.75 37.3,38.53 C52.P$1 36.6,39.23 36.6,40.5 35.84,41.26 34.47,41.26 33.55,42.18 U4.23
XTAL2
  Top 0.254: X4.3 38.4,36.9 38.4,38.62 38.13,38.88 C53.P$1 37.96,39.05 37.16,39.86 37.16,40.94 36.43,41.67 34.68,41.67 34.05,42.3 U4.24

### Text on the board
tNames: 2 | 40 | 1 | 39 | Titan | 1 | 2 | TDI | TDO | VDD | TMS | TCK | RESET | GND | 9 | 10 | 2 | 10 | 1 | 2 | 9 | 1 | 1 | 2 | 19 | 20 | 20 | 19 | GND | 2 | 1 | 3.3V | 5V | E | 9 | 10
bNames: Titan